# EAGLE design sensors-and-control-r2 (EAGLE 9.1.3)

## Sheet 1 of 3
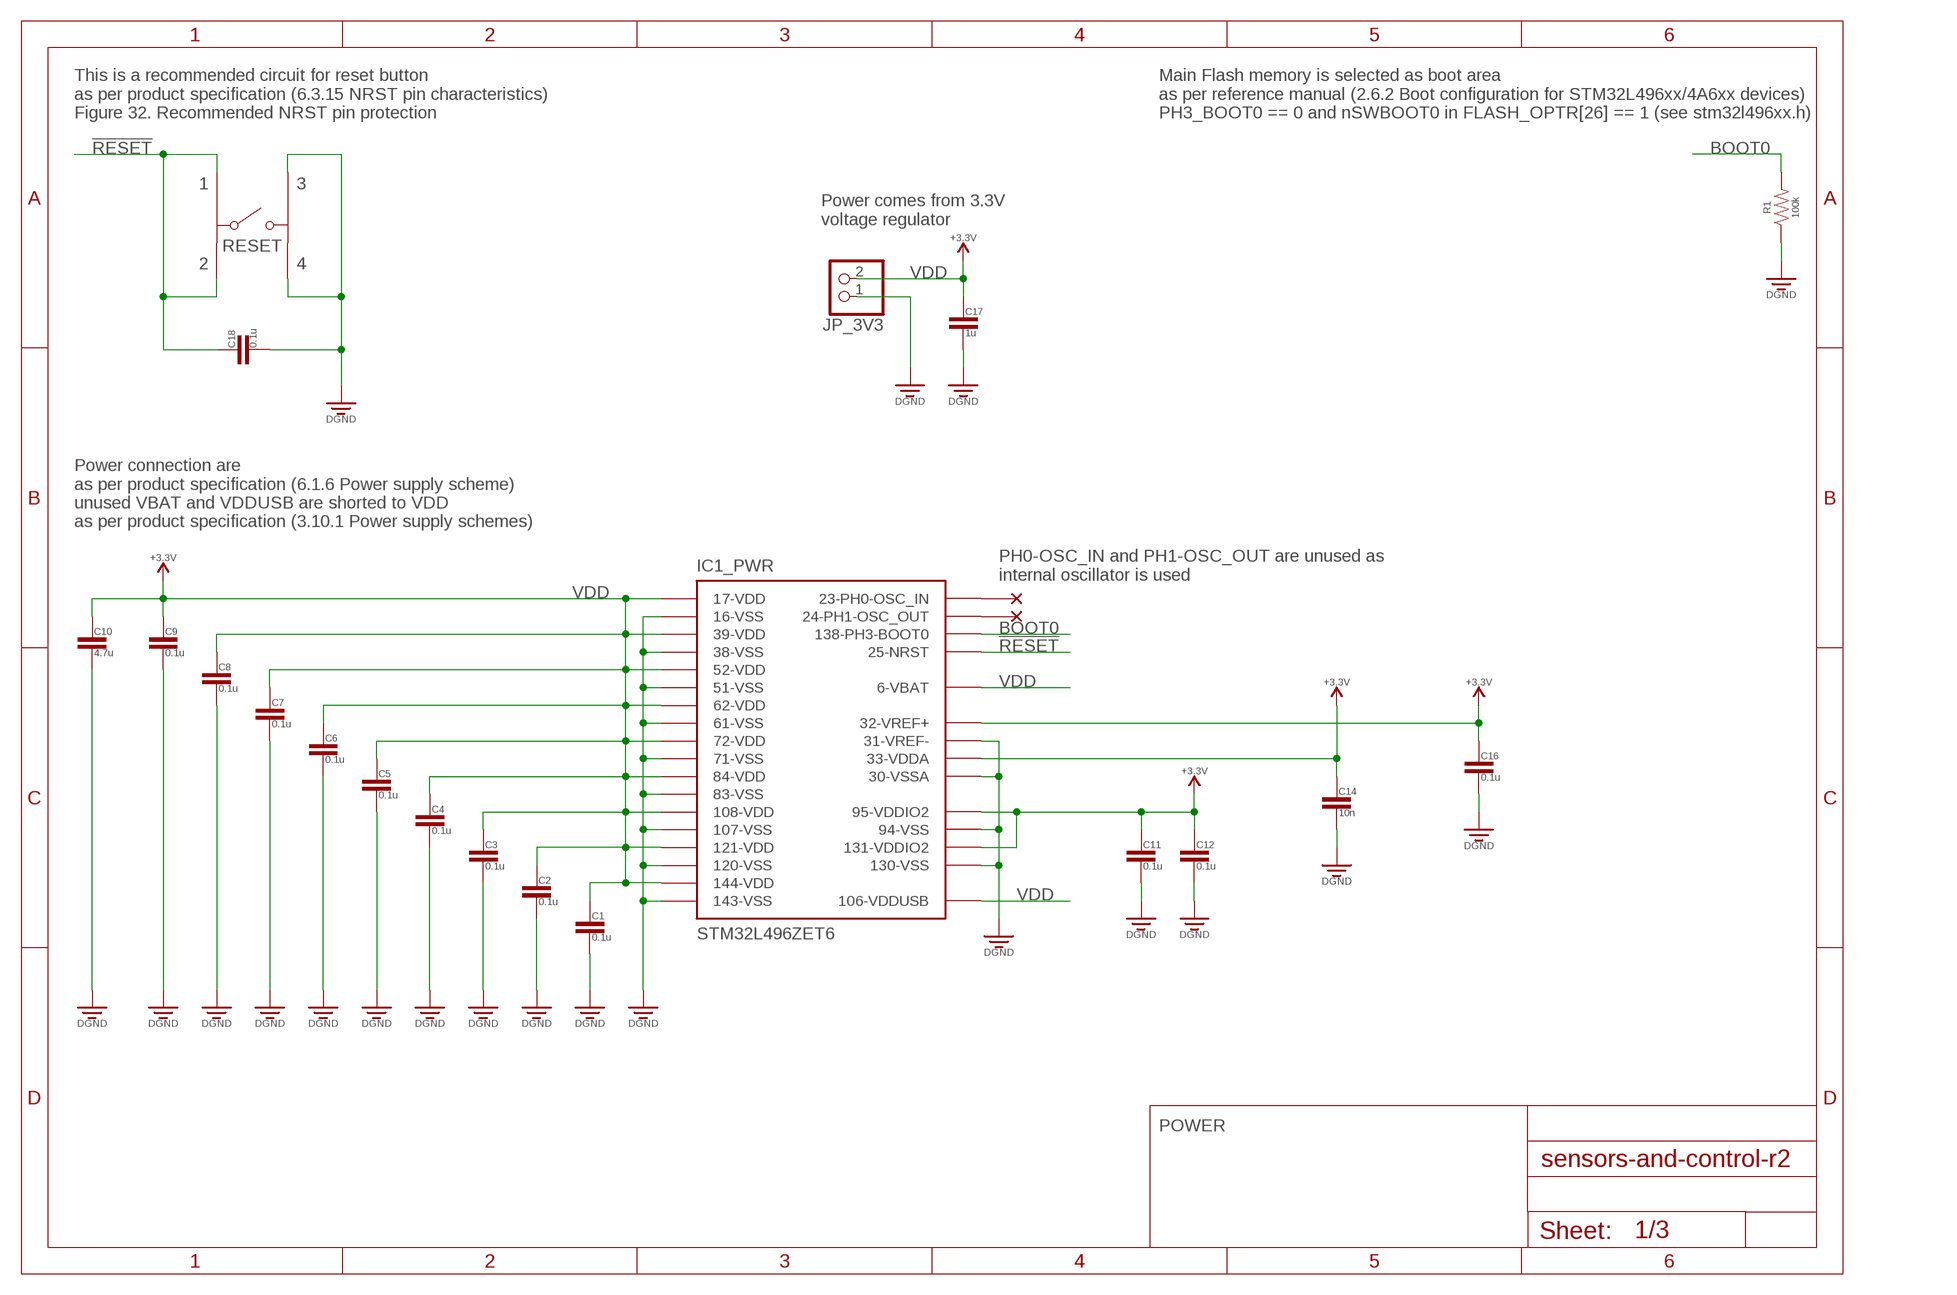
[diagram p0: schematic, sheet 1]

### Parts
C1  0.1u  CAPACITOR0603  [CAPACITOR-0603]
C2  0.1u  CAPACITOR0603  [CAPACITOR-0603]
C3  0.1u  CAPACITOR0603  [CAPACITOR-0603]
C4  0.1u  CAPACITOR0603  [CAPACITOR-0603]
C5  0.1u  CAPACITOR0603  [CAPACITOR-0603]
C6  0.1u  CAPACITOR0603  [CAPACITOR-0603]
C7  0.1u  CAPACITOR0603  [CAPACITOR-0603]
C8  0.1u  CAPACITOR0603  [CAPACITOR-0603]
C9  0.1u  CAPACITOR0603  [CAPACITOR-0603]
C10  4.7u  CAPACITOR0603  [CAPACITOR-0603]
C11  0.1u  CAPACITOR0603  [CAPACITOR-0603]
C12  0.1u  CAPACITOR0603  [CAPACITOR-0603]
C14  10n  CAPACITOR0603  [CAPACITOR-0603]
C16  0.1u  CAPACITOR0603  [CAPACITOR-0603]
C17  1u  CAPACITOR0603  [CAPACITOR-0603]
C18  0.1u  CAPACITOR0603  [CAPACITOR-0603]
IC1  STM32L496ZET6  [LQFP144_20X20]
JP_3V3  WURTH_691103110002  [2_PINS,3.5MM_PITCH]
R1  100k  RESISTOR_0.1W  [RESISTOR-0603]
RESET  FSM6JSMAASTR  [FSMJSM]
SUPPLY1  +3.3V  (no package)
SUPPLY2  +3.3V  (no package)
SUPPLY3  +3.3V  (no package)
SUPPLY4  +3.3V  (no package)
SUPPLY5  +3.3V  (no package)
U$2  NC  (no package)
U$3  NC  (no package)

### Nets
!RESET: C18.1 IC1.25(_PWR:25-NRST) RESET.P$2 RESET.P$4 ; also sheet 2
BOOT0: IC1.138(_PWR:138-PH3-BOOT0) R1.P$2
DGND: C1.2 C2.2 C3.2 C4.2 C5.2 C6.2 C7.2 C8.2 C9.2 C10.2 C11.2 C12.2 C14.2 C16.2 C17.2 C18.2 IC1.16(_PWR:16-VSS) IC1.30(_PWR:30-VSSA) IC1.31(_PWR:31-VREF-) IC1.38(_PWR:38-VSS) IC1.51(_PWR:51-VSS) IC1.61(_PWR:61-VSS) IC1.71(_PWR:71-VSS) IC1.83(_PWR:83-VSS) IC1.94(_PWR:94-VSS) IC1.107(_PWR:107-VSS) IC1.120(_PWR:120-VSS) IC1.130(_PWR:130-VSS) IC1.143(_PWR:143-VSS) JP_3V3.1 R1.P$1 RESET.P$1 RESET.P$3 ; also sheet 2,3
N$4: IC1.24(_PWR:24-PH1-OSC_OUT) U$2.1
N$5: IC1.23(_PWR:23-PH0-OSC_IN) U$3.1
VDD: C1.1 C2.1 C3.1 C4.1 C5.1 C6.1 C7.1 C8.1 C9.1 C10.1 C11.1 C12.1 C14.1 C16.1 C17.1 IC1.6(_PWR:6-VBAT) IC1.17(_PWR:17-VDD) IC1.32(_PWR:32-VREF+) IC1.33(_PWR:33-VDDA) IC1.39(_PWR:39-VDD) IC1.52(_PWR:52-VDD) IC1.62(_PWR:62-VDD) IC1.72(_PWR:72-VDD) IC1.84(_PWR:84-VDD) IC1.95(_PWR:95-VDDIO2) IC1.106(_PWR:106-VDDUSB) IC1.108(_PWR:108-VDD) IC1.121(_PWR:121-VDD) IC1.131(_PWR:131-VDDIO2) IC1.144(_PWR:144-VDD) JP_3V3.2 SUPPLY1.VCC SUPPLY2.VCC SUPPLY3.VCC SUPPLY4.VCC SUPPLY5.VCC ; also sheet 2,3

### Notes on the sheet
- This is a recommended circuit for reset button
  as per product specification (6.3.15 NRST pin characteristics)
  Figure 32. Recommended NRST pin protection
- Main Flash memory is selected as boot area
  as per reference manual (2.6.2 Boot configuration for STM32L496xx/4A6xx devices)
  PH3_BOOT0 == 0 and nSWBOOT0 in FLASH_OPTR[26] == 1 (see stm32l496xx.h)
- Power comes from 3.3V
  voltage regulator
- Power connection are
  as per product specification (6.1.6 Power supply scheme)
  unused VBAT and VDDUSB are shorted to VDD
  as per product specification (3.10.1 Power supply schemes)
- PH0-OSC_IN and PH1-OSC_OUT are unused as
  internal oscillator is used
- POWER

## Sheet 2 of 3
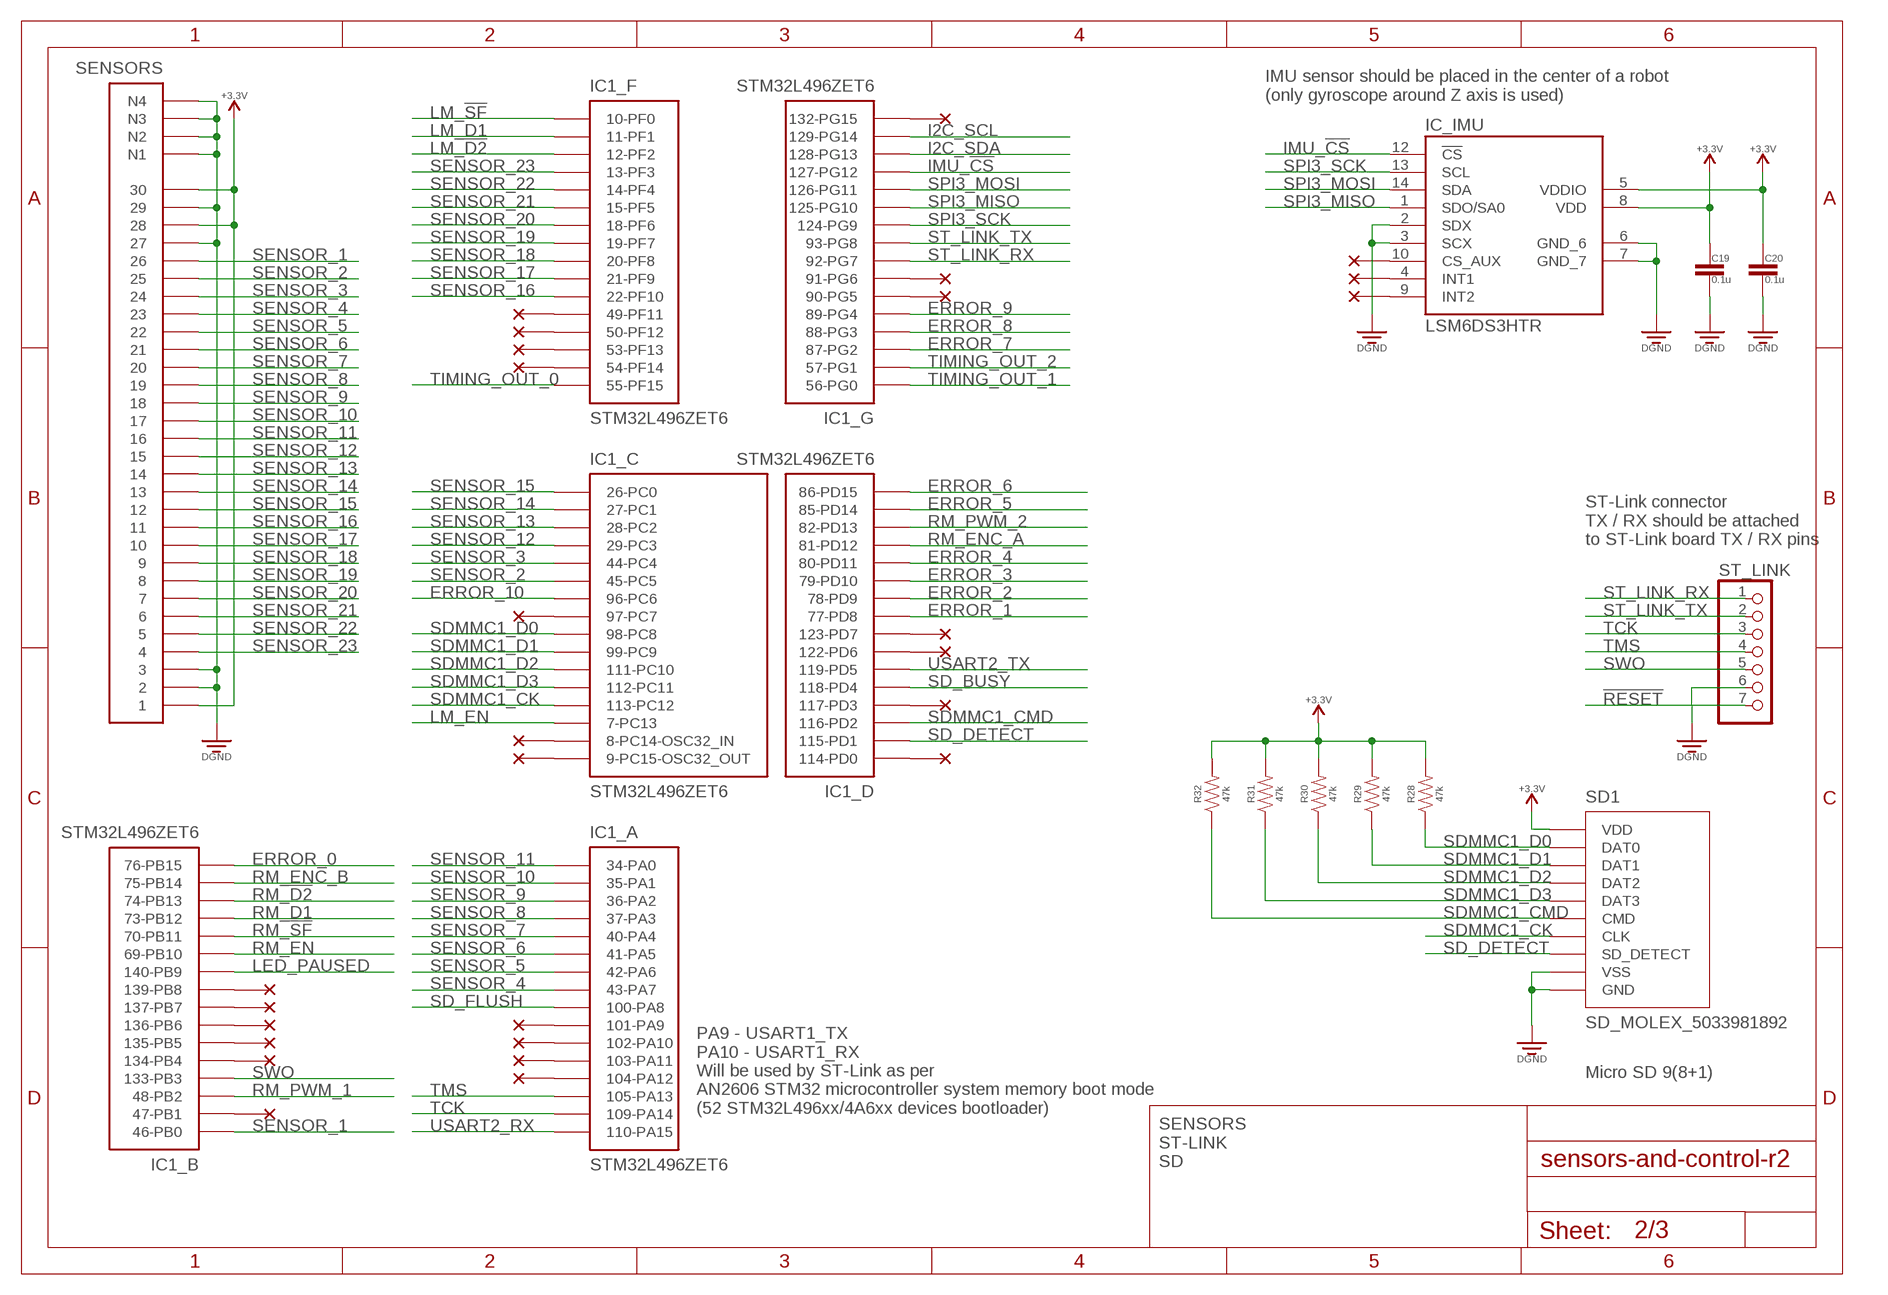
[diagram p1: schematic, sheet 2]

### Parts
C19  0.1u  CAPACITOR0603  [CAPACITOR-0603]
C20  0.1u  CAPACITOR0603  [CAPACITOR-0603]
IC_IMU  LSM6DS3HTR  [LGA-14L]
R28  47k  RESISTOR_0.1W  [RESISTOR-0603]
R29  47k  RESISTOR_0.1W  [RESISTOR-0603]
R30  47k  RESISTOR_0.1W  [RESISTOR-0603]
R31  47k  RESISTOR_0.1W  [RESISTOR-0603]
R32  47k  RESISTOR_0.1W  [RESISTOR-0603]
SD1  SD_MOLEX_5033981892  [SD_MOLEX_5033981892]
SENSORS  MOLEX-501931-3070  [MOLEX-501931-3070]
ST_LINK  PINHD-1X7  [1X07]
SUPPLY6  +3.3V  (no package)
SUPPLY7  +3.3V  (no package)
SUPPLY8  +3.3V  (no package)
SUPPLY9  +3.3V  (no package)
SUPPLY14  +3.3V  (no package)
U$1  NC  (no package)
U$4  NC  (no package)
U$5  NC  (no package)
U$11  NC  (no package)
U$12  NC  (no package)
U$13  NC  (no package)
U$14  NC  (no package)
U$15  NC  (no package)
U$16  NC  (no package)
U$17  NC  (no package)
U$18  NC  (no package)
U$19  NC  (no package)
U$20  NC  (no package)
U$21  NC  (no package)
U$22  NC  (no package)
U$23  NC  (no package)
U$25  NC  (no package)
U$26  NC  (no package)
U$27  NC  (no package)
U$29  NC  (no package)
U$31  NC  (no package)
U$32  NC  (no package)
U$33  NC  (no package)
U$34  NC  (no package)
U$35  NC  (no package)
U$36  NC  (no package)
U$37  NC  (no package)

### Nets
!RESET: ST_LINK.7 ; also sheet 1
DGND: C19.2 C20.2 IC_IMU.2(SDX) IC_IMU.3(SCX) IC_IMU.6(GND_6) IC_IMU.7(GND_7) SD1.6(VSS) SD1.DLM(GND) SENSORS.2 SENSORS.3 SENSORS.27 SENSORS.29 SENSORS.NAIL1(N1) SENSORS.NAIL2(N2) SENSORS.NAIL3(N3) SENSORS.NAIL4(N4) ST_LINK.6 ; also sheet 1,3
ERROR_0: IC1.76(_B:76-PB15) ; also sheet 3
ERROR_1: IC1.77(_D:77-PD8) ; also sheet 3
ERROR_2: IC1.78(_D:78-PD9) ; also sheet 3
ERROR_3: IC1.79(_D:79-PD10) ; also sheet 3
ERROR_4: IC1.80(_D:80-PD11) ; also sheet 3
ERROR_5: IC1.85(_D:85-PD14) ; also sheet 3
ERROR_6: IC1.86(_D:86-PD15) ; also sheet 3
ERROR_7: IC1.87(_G:87-PG2) ; also sheet 3
ERROR_8: IC1.88(_G:88-PG3) ; also sheet 3
ERROR_9: IC1.89(_G:89-PG4) ; also sheet 3
ERROR_10: IC1.96(_C:96-PC6) ; also sheet 3
I2C_SCL: IC1.129(_G:129-PG14) ; also sheet 3
I2C_SDA: IC1.128(_G:128-PG13) ; also sheet 3
IMU_!CS: IC1.127(_G:127-PG12) IC_IMU.12(!CS!)
LED_PAUSED: IC1.140(_B:140-PB9) ; also sheet 3
LM_!D2: IC1.12(_F:12-PF2) ; also sheet 3
LM_!SF: IC1.10(_F:10-PF0) ; also sheet 3
LM_D1: IC1.11(_F:11-PF1) ; also sheet 3
LM_EN: IC1.7(_C:7-PC13) ; also sheet 3
N$1: IC_IMU.10(CS_AUX) U$1.1
N$2: IC_IMU.4(INT1) U$4.1
N$6: IC_IMU.9(INT2) U$5.1
N$27: IC1.114(_D:114-PD0) U$11.1
N$28: IC1.101(_A:101-PA9) U$12.1
N$29: IC1.117(_D:117-PD3) U$13.1
N$30: IC1.103(_A:103-PA11) U$14.1
N$31: IC1.122(_D:122-PD6) U$15.1
N$32: IC1.123(_D:123-PD7) U$16.1
N$33: IC1.91(_G:91-PG6) U$17.1
N$34: IC1.90(_G:90-PG5) U$18.1
N$35: IC1.104(_A:104-PA12) U$19.1
N$36: IC1.49(_F:49-PF11) U$20.1
N$37: IC1.50(_F:50-PF12) U$21.1
N$38: IC1.53(_F:53-PF13) U$22.1
N$39: IC1.54(_F:54-PF14) U$23.1
N$41: IC1.97(_C:97-PC7) U$25.1
N$42: IC1.8(_C:8-PC14-OSC32_IN) U$26.1
N$43: IC1.9(_C:9-PC15-OSC32_OUT) U$27.1
N$45: IC1.132(_G:132-PG15) U$29.1
N$47: IC1.137(_B:137-PB7) U$31.1
N$48: IC1.139(_B:139-PB8) U$32.1
N$49: IC1.136(_B:136-PB6) U$33.1
N$50: IC1.135(_B:135-PB5) U$34.1
N$51: IC1.134(_B:134-PB4) U$35.1
N$52: IC1.47(_B:47-PB1) U$36.1
N$54: IC1.102(_A:102-PA10) U$37.1
RM_!D2: IC1.74(_B:74-PB13) ; also sheet 3
RM_!SF: IC1.70(_B:70-PB11) ; also sheet 3
RM_D1: IC1.73(_B:73-PB12) ; also sheet 3
RM_EN: IC1.69(_B:69-PB10) ; also sheet 3
RM_ENC_A: IC1.81(_D:81-PD12) ; also sheet 3
RM_ENC_B: IC1.75(_B:75-PB14) ; also sheet 3
RM_PWM_1: IC1.48(_B:48-PB2) ; also sheet 3
RM_PWM_2: IC1.82(_D:82-PD13) ; also sheet 3
SD_BUSY: IC1.118(_D:118-PD4) ; also sheet 3
SD_DETECT: IC1.115(_D:115-PD1) SD1.DSM(SD_DETECT)
SD_FLUSH: IC1.100(_A:100-PA8) ; also sheet 3
SDMMC1_CK: IC1.113(_C:113-PC12) SD1.5(CLK)
SDMMC1_CMD: IC1.116(_D:116-PD2) R32.P$1 SD1.3(CMD)
SDMMC1_D0: IC1.98(_C:98-PC8) R28.P$1 SD1.7(DAT0)
SDMMC1_D1: IC1.99(_C:99-PC9) R29.P$1 SD1.8(DAT1)
SDMMC1_D2: IC1.111(_C:111-PC10) R30.P$1 SD1.1(DAT2)
SDMMC1_D3: IC1.112(_C:112-PC11) R31.P$1 SD1.2(DAT3)
SENSOR_1: IC1.46(_B:46-PB0) SENSORS.26
SENSOR_2: IC1.45(_C:45-PC5) SENSORS.25
SENSOR_3: IC1.44(_C:44-PC4) SENSORS.24
SENSOR_4: IC1.43(_A:43-PA7) SENSORS.23
SENSOR_5: IC1.42(_A:42-PA6) SENSORS.22
SENSOR_6: IC1.41(_A:41-PA5) SENSORS.21
SENSOR_7: IC1.40(_A:40-PA4) SENSORS.20
SENSOR_8: IC1.37(_A:37-PA3) SENSORS.19
SENSOR_9: IC1.36(_A:36-PA2) SENSORS.18
SENSOR_10: IC1.35(_A:35-PA1) SENSORS.17
SENSOR_11: IC1.34(_A:34-PA0) SENSORS.16
SENSOR_12: IC1.29(_C:29-PC3) SENSORS.15
SENSOR_13: IC1.28(_C:28-PC2) SENSORS.14
SENSOR_14: IC1.27(_C:27-PC1) SENSORS.13
SENSOR_15: IC1.26(_C:26-PC0) SENSORS.12
SENSOR_16: IC1.22(_F:22-PF10) SENSORS.11
SENSOR_17: IC1.21(_F:21-PF9) SENSORS.10
SENSOR_18: IC1.20(_F:20-PF8) SENSORS.9
SENSOR_19: IC1.19(_F:19-PF7) SENSORS.8
SENSOR_20: IC1.18(_F:18-PF6) SENSORS.7
SENSOR_21: IC1.15(_F:15-PF5) SENSORS.6
SENSOR_22: IC1.14(_F:14-PF4) SENSORS.5
SENSOR_23: IC1.13(_F:13-PF3) SENSORS.4
SPI3_MISO: IC1.125(_G:125-PG10) IC_IMU.1(SDO/SA0)
SPI3_MOSI: IC1.126(_G:126-PG11) IC_IMU.14(SDA)
SPI3_SCK: IC1.124(_G:124-PG9) IC_IMU.13(SCL)
ST_LINK_RX: IC1.92(_G:92-PG7) ST_LINK.1
ST_LINK_TX: IC1.93(_G:93-PG8) ST_LINK.2
SWO: IC1.133(_B:133-PB3) ST_LINK.5
TCK: IC1.109(_A:109-PA14) ST_LINK.3
TIMING_OUT_0: IC1.55(_F:55-PF15) ; also sheet 3
TIMING_OUT_1: IC1.56(_G:56-PG0) ; also sheet 3
TIMING_OUT_2: IC1.57(_G:57-PG1) ; also sheet 3
TMS: IC1.105(_A:105-PA13) ST_LINK.4
USART2_RX: IC1.110(_A:110-PA15) ; also sheet 3
USART2_TX: IC1.119(_D:119-PD5) ; also sheet 3
VDD: C19.1 C20.1 IC_IMU.5(VDDIO) IC_IMU.8(VDD) R28.P$2 R29.P$2 R30.P$2 R31.P$2 R32.P$2 SD1.4(VDD) SENSORS.1 SENSORS.28 SENSORS.30 SUPPLY6.VCC SUPPLY7.VCC SUPPLY8.VCC SUPPLY9.VCC SUPPLY14.VCC ; also sheet 1,3

### Notes on the sheet
- IMU sensor should be placed in the center of a robot
  (only gyroscope around Z axis is used)
- ST-Link connector
  TX / RX should be attached
  to ST-Link board TX / RX pins
- Micro SD 9(8+1)
- PA9 - USART1_TX
  PA10 - USART1_RX
  Will be used by ST-Link as per
  AN2606 STM32 microcontroller system memory boot mode
  (52 STM32L496xx/4A6xx devices bootloader)
- SENSORS
  ST-LINK
  SD

## Sheet 3 of 3
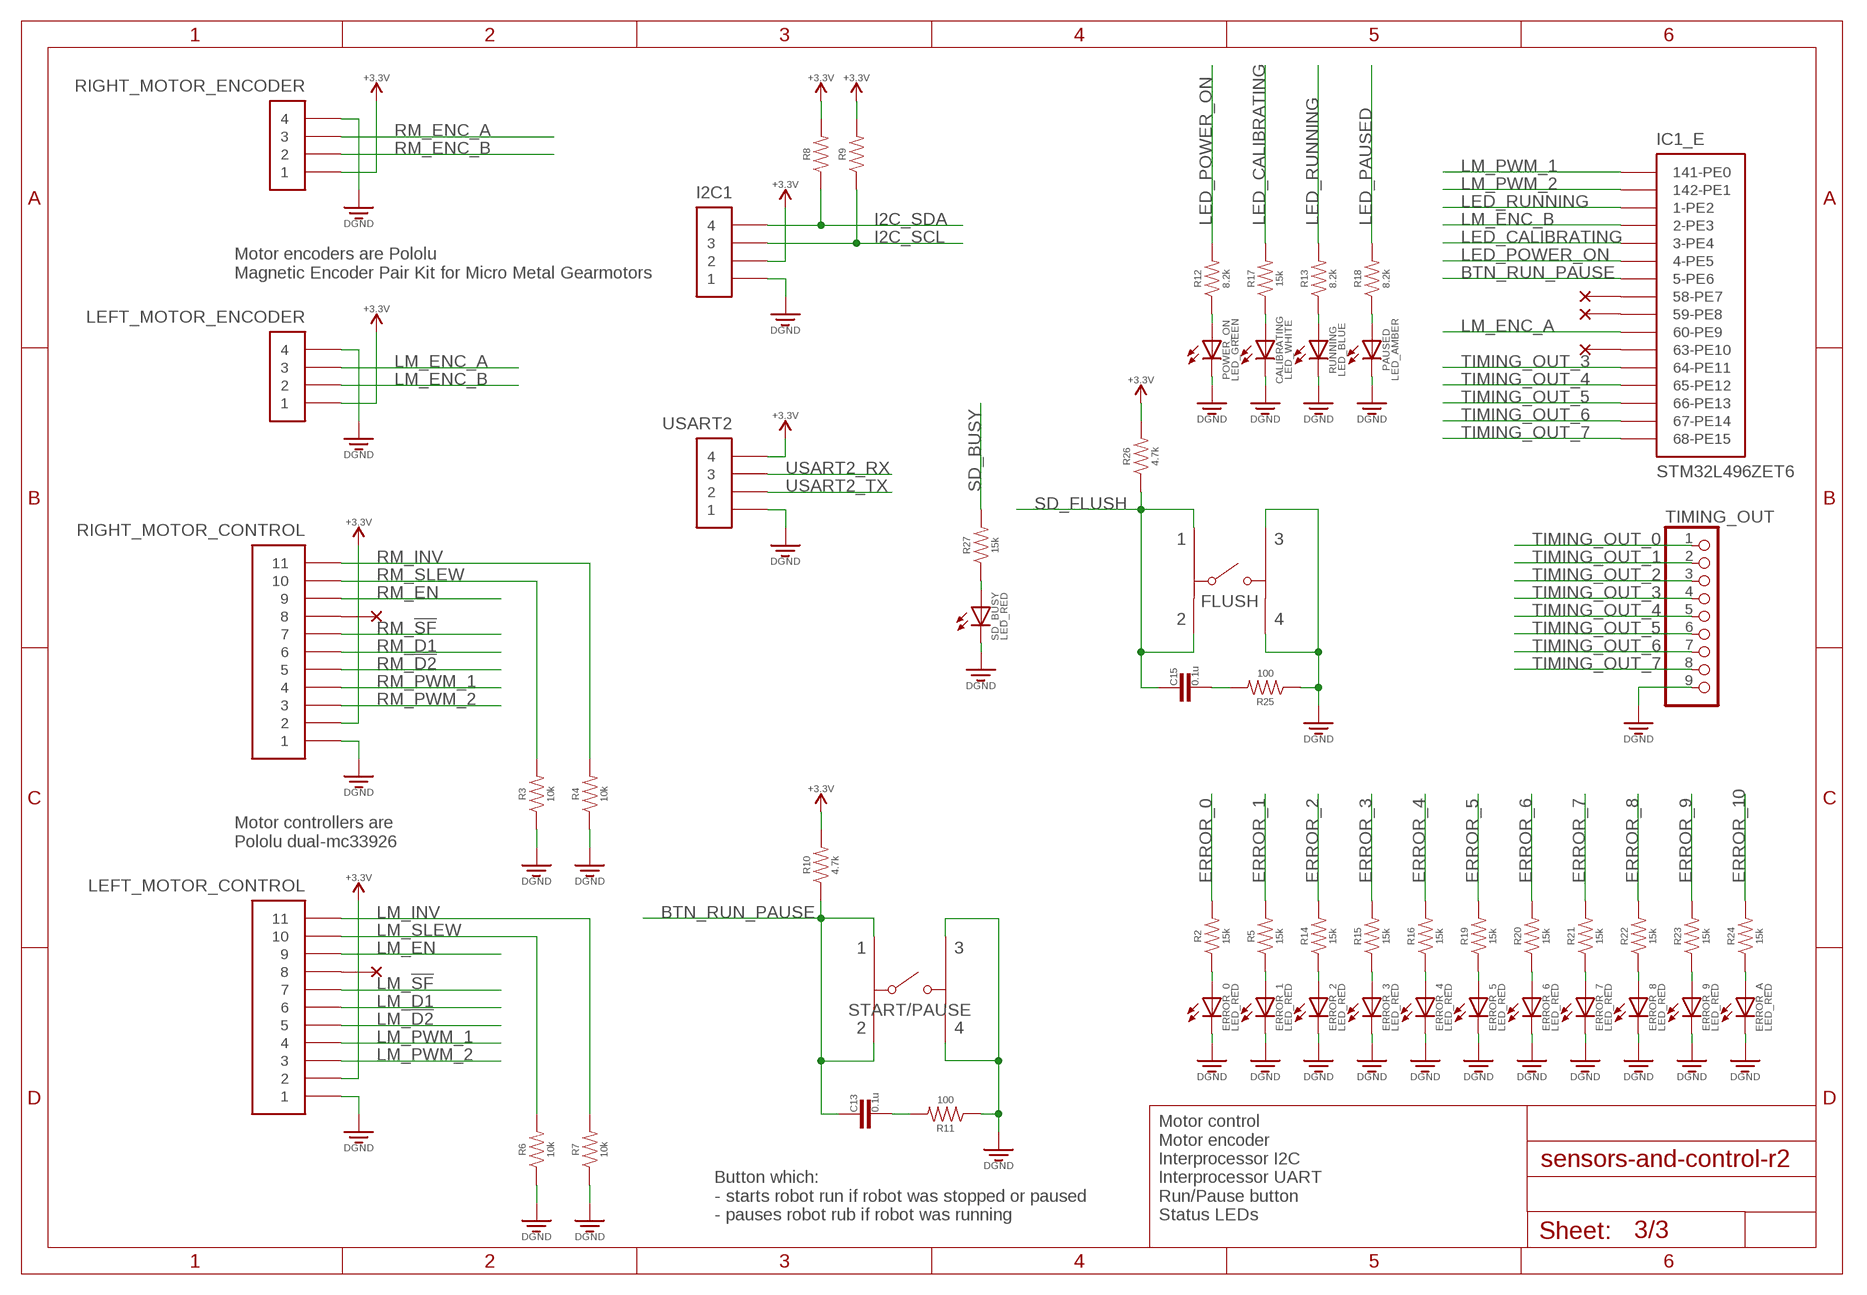
[diagram p2: schematic, sheet 3]

### Parts
C13  0.1u  CAPACITOR0603  [CAPACITOR-0603]
C15  0.1u  CAPACITOR0603  [CAPACITOR-0603]
CALIBRATING  LED_WHITE  [ESS_II_TYPE_LED]
ERROR_0  LED_RED  [ESS_II_TYPE_LED]
ERROR_1  LED_RED  [ESS_II_TYPE_LED]
ERROR_2  LED_RED  [ESS_II_TYPE_LED]
ERROR_3  LED_RED  [ESS_II_TYPE_LED]
ERROR_4  LED_RED  [ESS_II_TYPE_LED]
ERROR_5  LED_RED  [ESS_II_TYPE_LED]
ERROR_6  LED_RED  [ESS_II_TYPE_LED]
ERROR_7  LED_RED  [ESS_II_TYPE_LED]
ERROR_8  LED_RED  [ESS_II_TYPE_LED]
ERROR_9  LED_RED  [ESS_II_TYPE_LED]
ERROR_A  LED_RED  [ESS_II_TYPE_LED]
FLUSH  FSM6JSMAASTR  [FSMJSM]
I2C1  1X4  [MOLEX-70553-0003]
LEFT_MOTOR_CONTROL  1X11  [MOLEX-70553-0010]
LEFT_MOTOR_ENCODER  1X4  [MOLEX-70553-0003]
PAUSED  LED_AMBER  [ESS_II_TYPE_LED]
POWER_ON  LED_GREEN  [ESS_II_TYPE_LED]
R2  15k  RESISTOR_0.1W  [RESISTOR-0603]
R3  10k  RESISTOR_0.1W  [RESISTOR-0603]
R4  10k  RESISTOR_0.1W  [RESISTOR-0603]
R5  15k  RESISTOR_0.1W  [RESISTOR-0603]
R6  10k  RESISTOR_0.1W  [RESISTOR-0603]
R7  10k  RESISTOR_0.1W  [RESISTOR-0603]
R8  RESISTOR_0.1W  [RESISTOR-0603]
R9  RESISTOR_0.1W  [RESISTOR-0603]
R10  4.7k  RESISTOR_0.1W  [RESISTOR-0603]
R11  100  RESISTOR_0.1W  [RESISTOR-0603]
R12  8.2k  RESISTOR_0.1W  [RESISTOR-0603]
R13  8.2k  RESISTOR_0.1W  [RESISTOR-0603]
R14  15k  RESISTOR_0.1W  [RESISTOR-0603]
R15  15k  RESISTOR_0.1W  [RESISTOR-0603]
R16  15k  RESISTOR_0.1W  [RESISTOR-0603]
R17  15k  RESISTOR_0.1W  [RESISTOR-0603]
R18  8.2k  RESISTOR_0.1W  [RESISTOR-0603]
R19  15k  RESISTOR_0.1W  [RESISTOR-0603]
R20  15k  RESISTOR_0.1W  [RESISTOR-0603]
R21  15k  RESISTOR_0.1W  [RESISTOR-0603]
R22  15k  RESISTOR_0.1W  [RESISTOR-0603]
R23  15k  RESISTOR_0.1W  [RESISTOR-0603]
R24  15k  RESISTOR_0.1W  [RESISTOR-0603]
R25  100  RESISTOR_0.1W  [RESISTOR-0603]
R26  4.7k  RESISTOR_0.1W  [RESISTOR-0603]
R27  15k  RESISTOR_0.1W  [RESISTOR-0603]
RIGHT_MOTOR_CONTROL  1X11  [MOLEX-70553-0010]
RIGHT_MOTOR_ENCODER  1X4  [MOLEX-70553-0003]
RUNNING  LED_BLUE  [ESS_II_TYPE_LED]
SD_BUSY  LED_RED  [ESS_II_TYPE_LED]
START/PAUSE  FSM6JSMAASTR  [FSMJSM]
SUPPLY10  +3.3V  (no package)
SUPPLY11  +3.3V  (no package)
SUPPLY12  +3.3V  (no package)
SUPPLY13  +3.3V  (no package)
SUPPLY16  +3.3V  (no package)
SUPPLY17  +3.3V  (no package)
SUPPLY18  +3.3V  (no package)
SUPPLY19  +3.3V  (no package)
SUPPLY20  +3.3V  (no package)
TIMING_OUT  PINHD-1X9  [1X09]
U$6  NC  (no package)
U$7  NC  (no package)
U$8  NC  (no package)
U$9  NC  (no package)
U$10  NC  (no package)
USART2  1X4  [MOLEX-70553-0003]
VDD  +3.3V  (no package)

### Nets
BTN_RUN_PAUSE: C13.1 IC1.5(_E:5-PE6) R10.P$1 START/PAUSE.P$2 START/PAUSE.P$4
DGND: CALIBRATING.P$2(C) ERROR_0.P$2(C) ERROR_1.P$2(C) ERROR_2.P$2(C) ERROR_3.P$2(C) ERROR_4.P$2(C) ERROR_5.P$2(C) ERROR_6.P$2(C) ERROR_7.P$2(C) ERROR_8.P$2(C) ERROR_9.P$2(C) ERROR_A.P$2(C) FLUSH.P$1 FLUSH.P$3 I2C1.1 LEFT_MOTOR_CONTROL.P$1 LEFT_MOTOR_ENCODER.4 PAUSED.P$2(C) POWER_ON.P$2(C) R3.P$1 R4.P$1 R6.P$1 R7.P$1 R11.P$1 R25.P$1 RIGHT_MOTOR_CONTROL.P$1 RIGHT_MOTOR_ENCODER.4 RUNNING.P$2(C) SD_BUSY.P$2(C) START/PAUSE.P$1 START/PAUSE.P$3 TIMING_OUT.9 USART2.1 ; also sheet 1,2
ERROR_0: R2.P$2 ; also sheet 2
ERROR_1: R5.P$2 ; also sheet 2
ERROR_2: R14.P$2 ; also sheet 2
ERROR_3: R15.P$2 ; also sheet 2
ERROR_4: R16.P$2 ; also sheet 2
ERROR_5: R19.P$2 ; also sheet 2
ERROR_6: R20.P$2 ; also sheet 2
ERROR_7: R21.P$2 ; also sheet 2
ERROR_8: R22.P$2 ; also sheet 2
ERROR_9: R23.P$2 ; also sheet 2
ERROR_10: R24.P$2 ; also sheet 2
I2C_SCL: I2C1.3 R9.P$1 ; also sheet 2
I2C_SDA: I2C1.4 R8.P$1 ; also sheet 2
LED_CALIBRATING: IC1.3(_E:3-PE4) R17.P$2
LED_PAUSED: R18.P$2 ; also sheet 2
LED_POWER_ON: IC1.4(_E:4-PE5) R12.P$2
LED_RUNNING: IC1.1(_E:1-PE2) R13.P$2
LM_!D2: LEFT_MOTOR_CONTROL.P$5 ; also sheet 2
LM_!SF: LEFT_MOTOR_CONTROL.P$7 ; also sheet 2
LM_D1: LEFT_MOTOR_CONTROL.P$6 ; also sheet 2
LM_EN: LEFT_MOTOR_CONTROL.P$9 ; also sheet 2
LM_ENC_A: IC1.60(_E:60-PE9) LEFT_MOTOR_ENCODER.3
LM_ENC_B: IC1.2(_E:2-PE3) LEFT_MOTOR_ENCODER.2
LM_INV: LEFT_MOTOR_CONTROL.P$11 R7.P$2
LM_PWM_1: IC1.141(_E:141-PE0) LEFT_MOTOR_CONTROL.P$4
LM_PWM_2: IC1.142(_E:142-PE1) LEFT_MOTOR_CONTROL.P$3
LM_SLEW: LEFT_MOTOR_CONTROL.P$10 R6.P$2
N$3: ERROR_0.P$1(A) R2.P$1
N$7: RIGHT_MOTOR_CONTROL.P$8 U$6.1
N$8: LEFT_MOTOR_CONTROL.P$8 U$7.1
N$9: ERROR_1.P$1(A) R5.P$1
N$10: POWER_ON.P$1(A) R12.P$1
N$11: C13.2 R11.P$2
N$12: R13.P$1 RUNNING.P$1(A)
N$13: ERROR_2.P$1(A) R14.P$1
N$14: ERROR_3.P$1(A) R15.P$1
N$15: ERROR_4.P$1(A) R16.P$1
N$16: CALIBRATING.P$1(A) R17.P$1
N$17: PAUSED.P$1(A) R18.P$1
N$18: ERROR_5.P$1(A) R19.P$1
N$19: ERROR_6.P$1(A) R20.P$1
N$20: ERROR_7.P$1(A) R21.P$1
N$21: ERROR_8.P$1(A) R22.P$1
N$22: ERROR_9.P$1(A) R23.P$1
N$23: ERROR_A.P$1(A) R24.P$1
N$24: IC1.63(_E:63-PE10) U$8.1
N$25: IC1.59(_E:59-PE8) U$9.1
N$26: IC1.58(_E:58-PE7) U$10.1
N$53: C15.2 R25.P$2
N$55: R27.P$1 SD_BUSY.P$1(A)
RM_!D2: RIGHT_MOTOR_CONTROL.P$5 ; also sheet 2
RM_!SF: RIGHT_MOTOR_CONTROL.P$7 ; also sheet 2
RM_D1: RIGHT_MOTOR_CONTROL.P$6 ; also sheet 2
RM_EN: RIGHT_MOTOR_CONTROL.P$9 ; also sheet 2
RM_ENC_A: RIGHT_MOTOR_ENCODER.3 ; also sheet 2
RM_ENC_B: RIGHT_MOTOR_ENCODER.2 ; also sheet 2
RM_INV: R4.P$2 RIGHT_MOTOR_CONTROL.P$11
RM_PWM_1: RIGHT_MOTOR_CONTROL.P$4 ; also sheet 2
RM_PWM_2: RIGHT_MOTOR_CONTROL.P$3 ; also sheet 2
RM_SLEW: R3.P$2 RIGHT_MOTOR_CONTROL.P$10
SD_BUSY: R27.P$2 ; also sheet 2
SD_FLUSH: C15.1 FLUSH.P$2 FLUSH.P$4 R26.P$1 ; also sheet 2
TIMING_OUT_0: TIMING_OUT.1 ; also sheet 2
TIMING_OUT_1: TIMING_OUT.2 ; also sheet 2
TIMING_OUT_2: TIMING_OUT.3 ; also sheet 2
TIMING_OUT_3: IC1.64(_E:64-PE11) TIMING_OUT.4
TIMING_OUT_4: IC1.65(_E:65-PE12) TIMING_OUT.5
TIMING_OUT_5: IC1.66(_E:66-PE13) TIMING_OUT.6
TIMING_OUT_6: IC1.67(_E:67-PE14) TIMING_OUT.7
TIMING_OUT_7: IC1.68(_E:68-PE15) TIMING_OUT.8
USART2_RX: USART2.3 ; also sheet 2
USART2_TX: USART2.2 ; also sheet 2
VDD: I2C1.2 LEFT_MOTOR_CONTROL.P$2 LEFT_MOTOR_ENCODER.1 R8.P$2 R9.P$2 R10.P$2 R26.P$2 RIGHT_MOTOR_CONTROL.P$2 RIGHT_MOTOR_ENCODER.1 SUPPLY10.VCC SUPPLY11.VCC SUPPLY12.VCC SUPPLY13.VCC SUPPLY16.VCC SUPPLY17.VCC SUPPLY18.VCC SUPPLY19.VCC SUPPLY20.VCC USART2.4 VDD.VCC ; also sheet 1,2

### Notes on the sheet
- Motor encoders are Pololu
  Magnetic Encoder Pair Kit for Micro Metal Gearmotors
- Motor controllers are
  Pololu dual-mc33926
- Button which:
  - starts robot run if robot was stopped or paused
  - pauses robot rub if robot was running
- Motor control
  Motor encoder
  Interprocessor I2C
  Interprocessor UART
  Run/Pause button
  Status LEDs

## Library data of the parts
C1-C20 = capacitors:CAPACITOR
CALIBRATING = led:LED_WHITE
ERROR_0 ERROR_1-ERROR_9 ERROR_A SD_BUSY = led:LED_RED
FLUSH RESET START/PAUSE = switches:FSM6JSMAASTR
I2C1 LEFT_MOTOR_ENCODER RIGHT_MOTOR_ENCODER USART2 = connectors:1X4
IC1 = mcu:STM32L496ZET6
IC_IMU = sensors:LSM6DS3HTR
JP_3V3 = connectors-power:WURTH_691103110002
LEFT_MOTOR_CONTROL RIGHT_MOTOR_CONTROL = connectors:1X11
PAUSED = led:LED_AMBER
POWER_ON = led:LED_GREEN
R1-R32 = resistors:RESISTOR_0.1W
RUNNING = led:LED_BLUE
SD1 = memory-card-interfaces:SD_MOLEX_5033981892
SENSORS = connectors:MOLEX-501931-3070
ST_LINK = pin-headers:PINHD-1X7: PIN HEADER
SUPPLY1-SUPPLY14 SUPPLY16-SUPPLY20 VDD = voltage-ground:+3.3V: +3.3V Voltage Supply Positive voltage supply (traditionally for a BJT device, C=collector).
TIMING_OUT = pin-headers:PINHD-1X9: PIN HEADER
U$1-U$23 U$25-U$27 U$29 U$31-U$37 = voltage-ground:NC

## Board
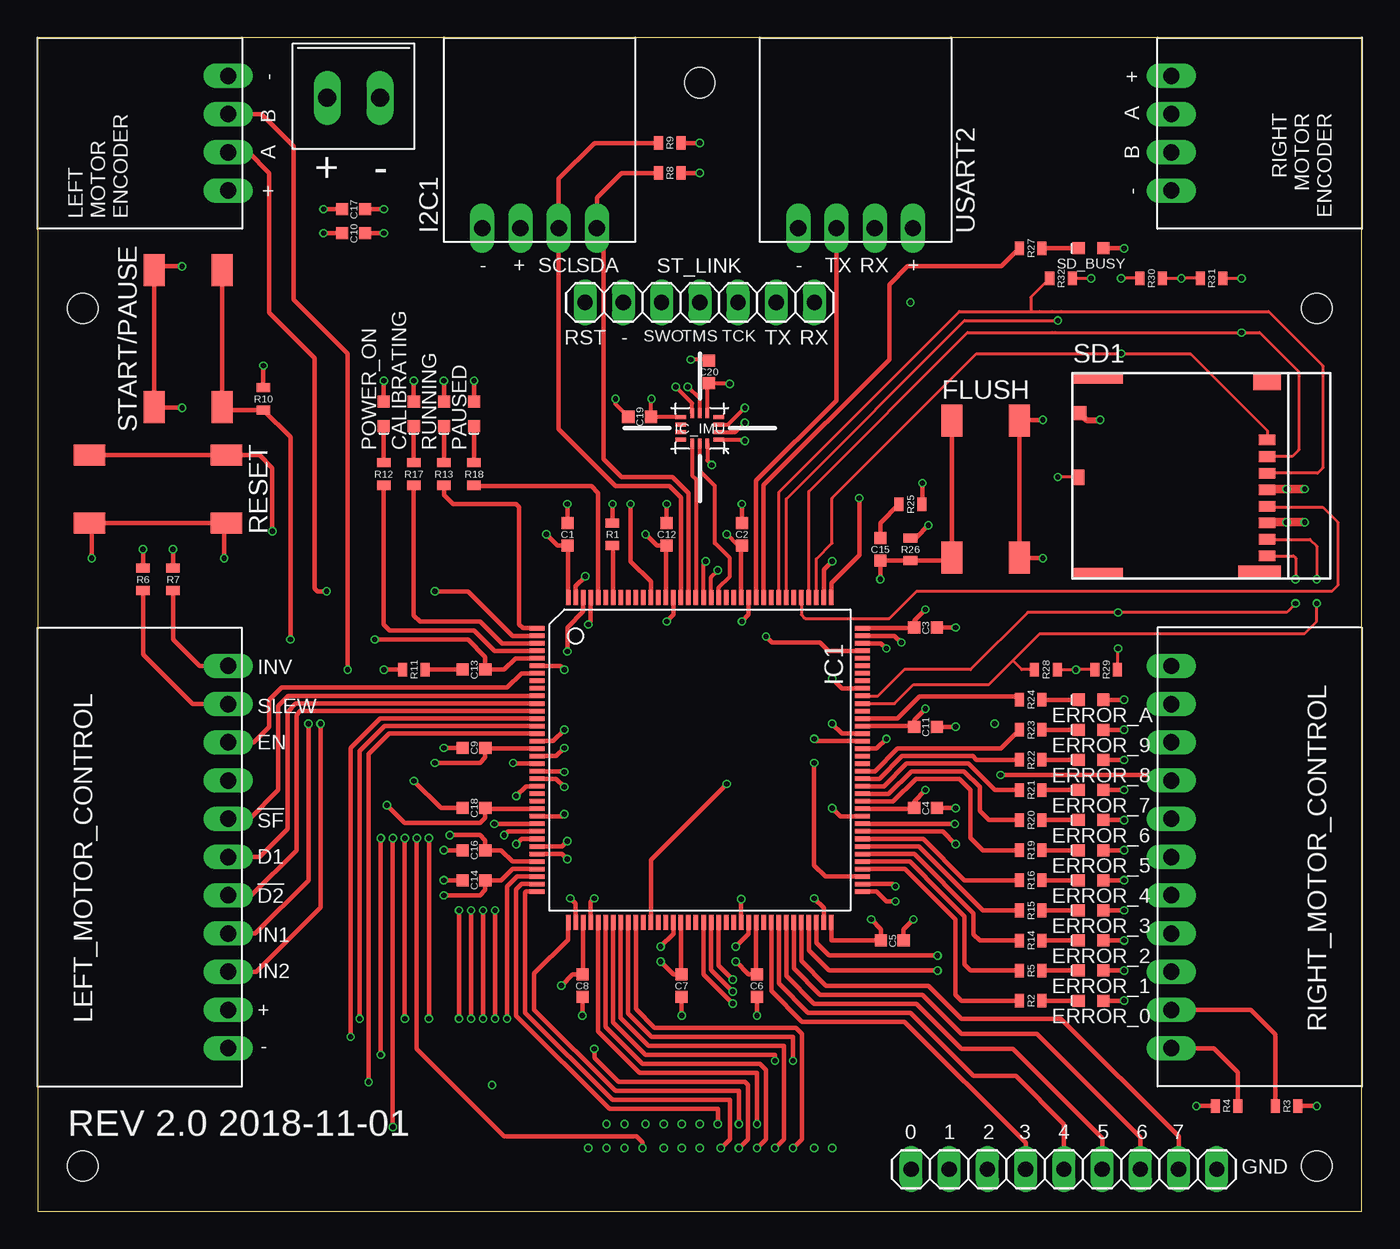
[diagram p3: board, top side]
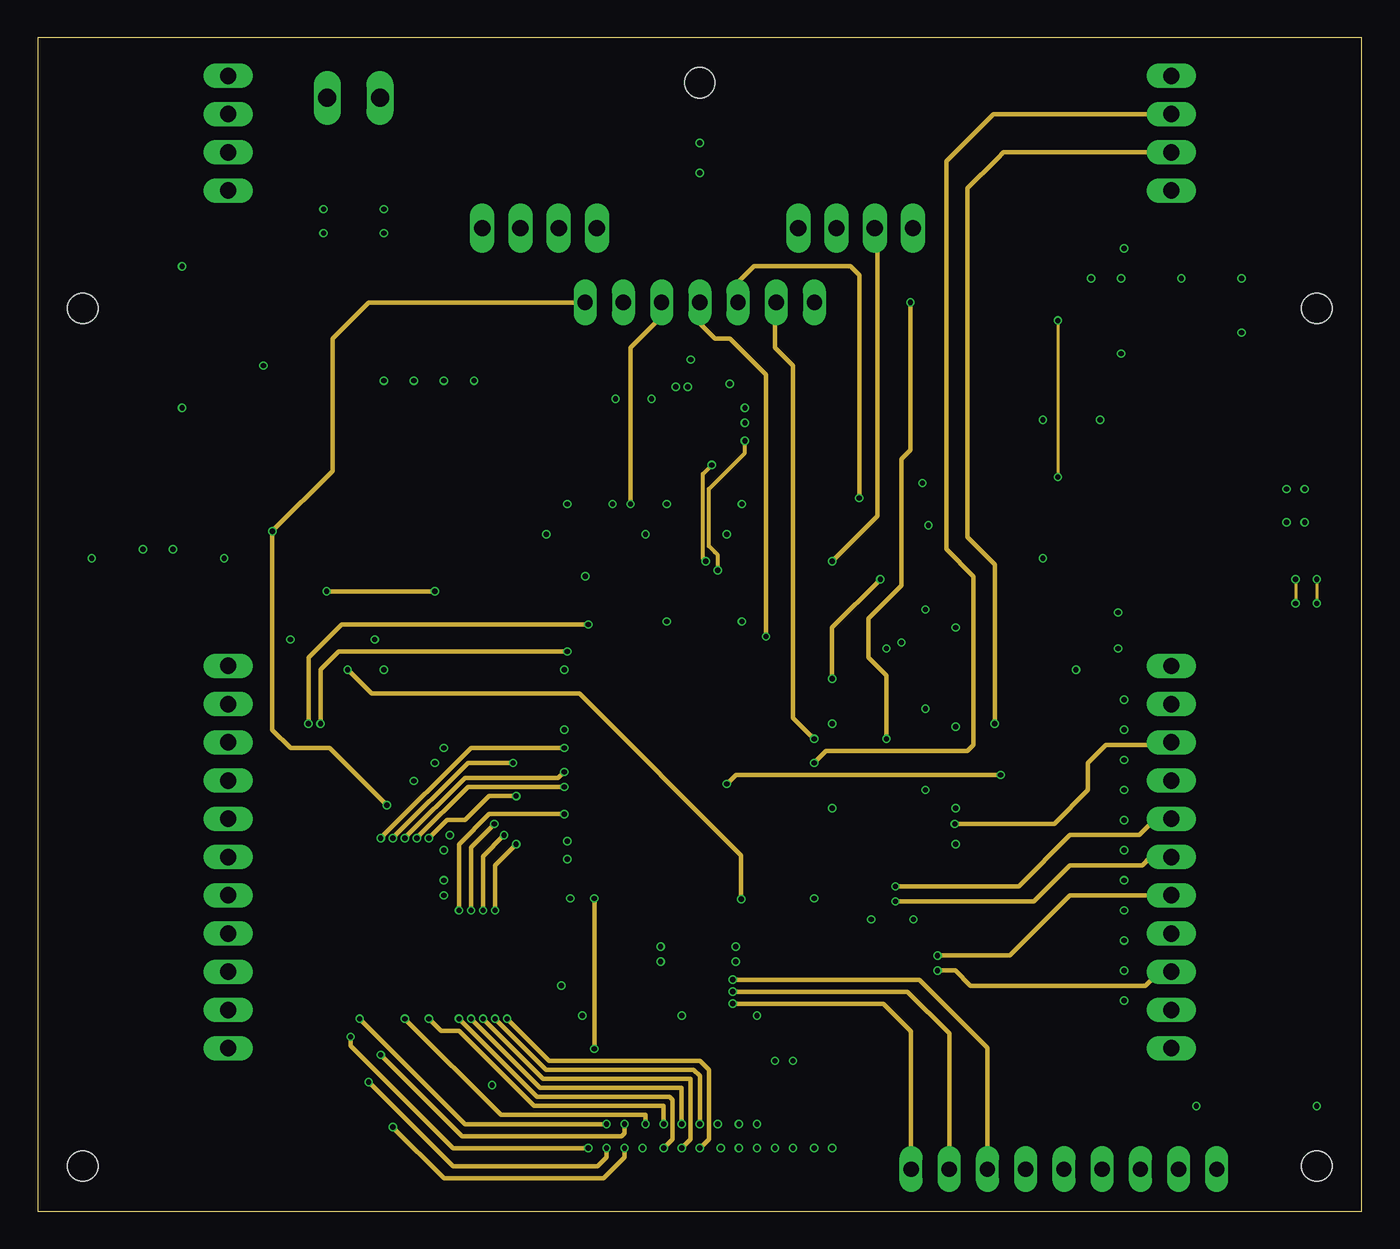
[diagram p4: board, inner layer Route2]
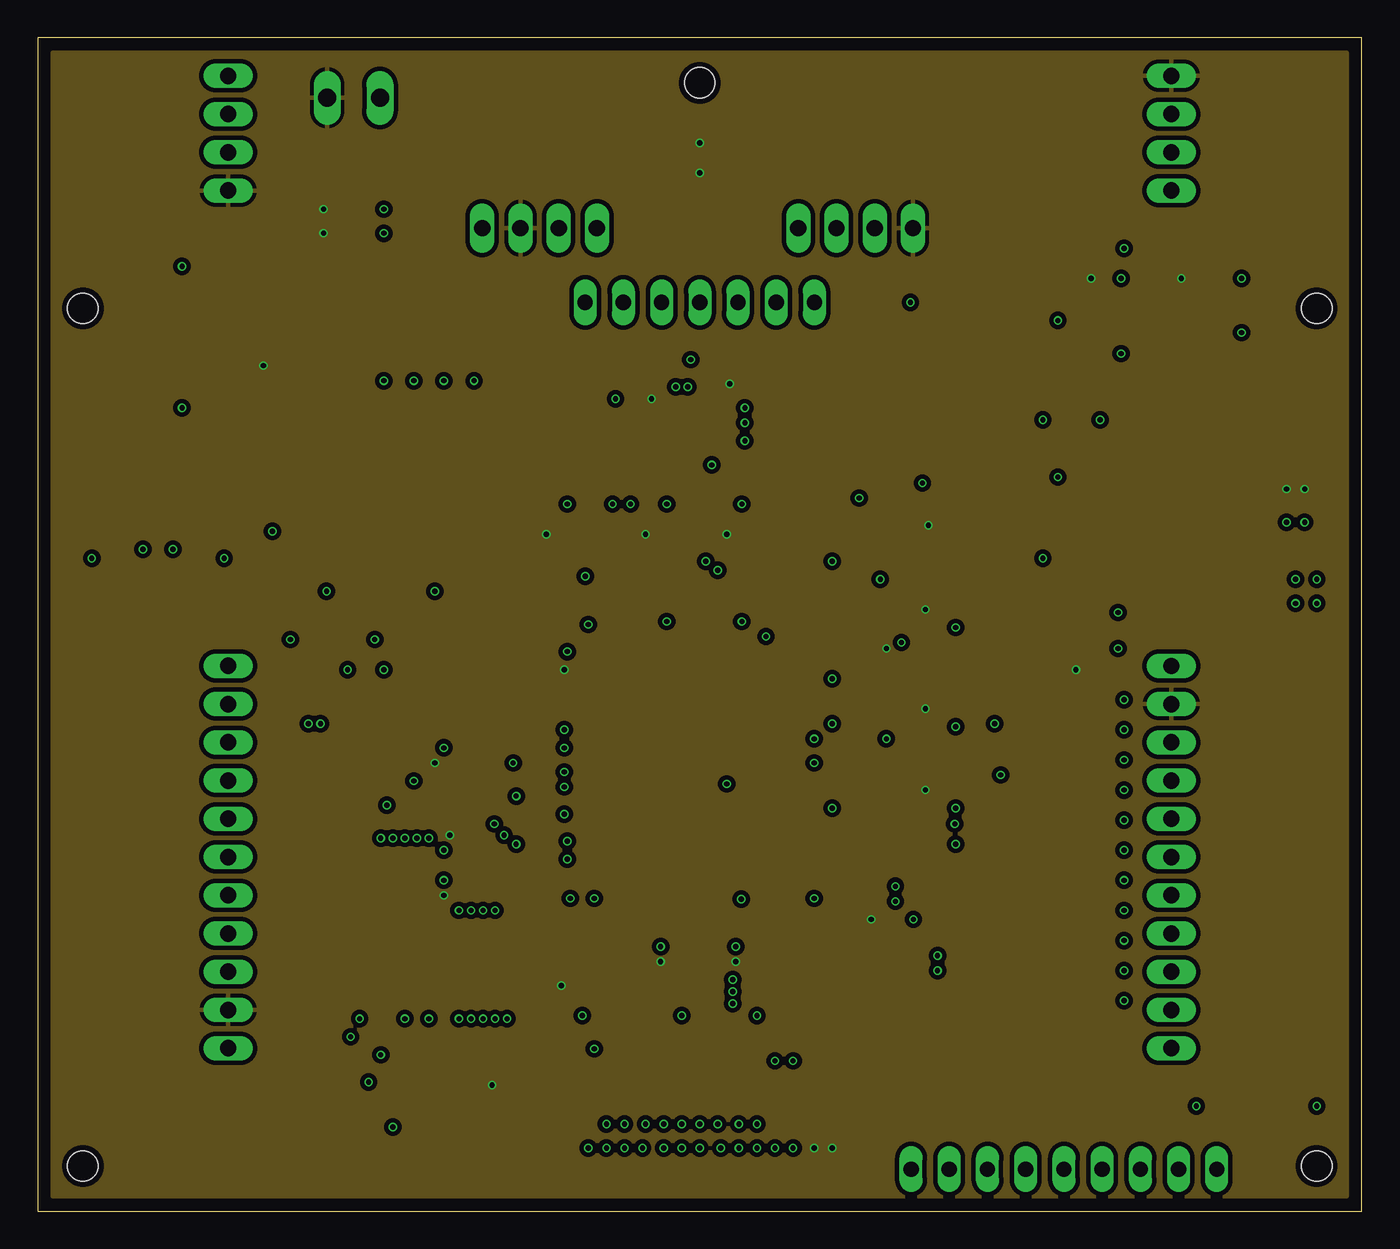
[diagram p5: board, inner layer Route15]
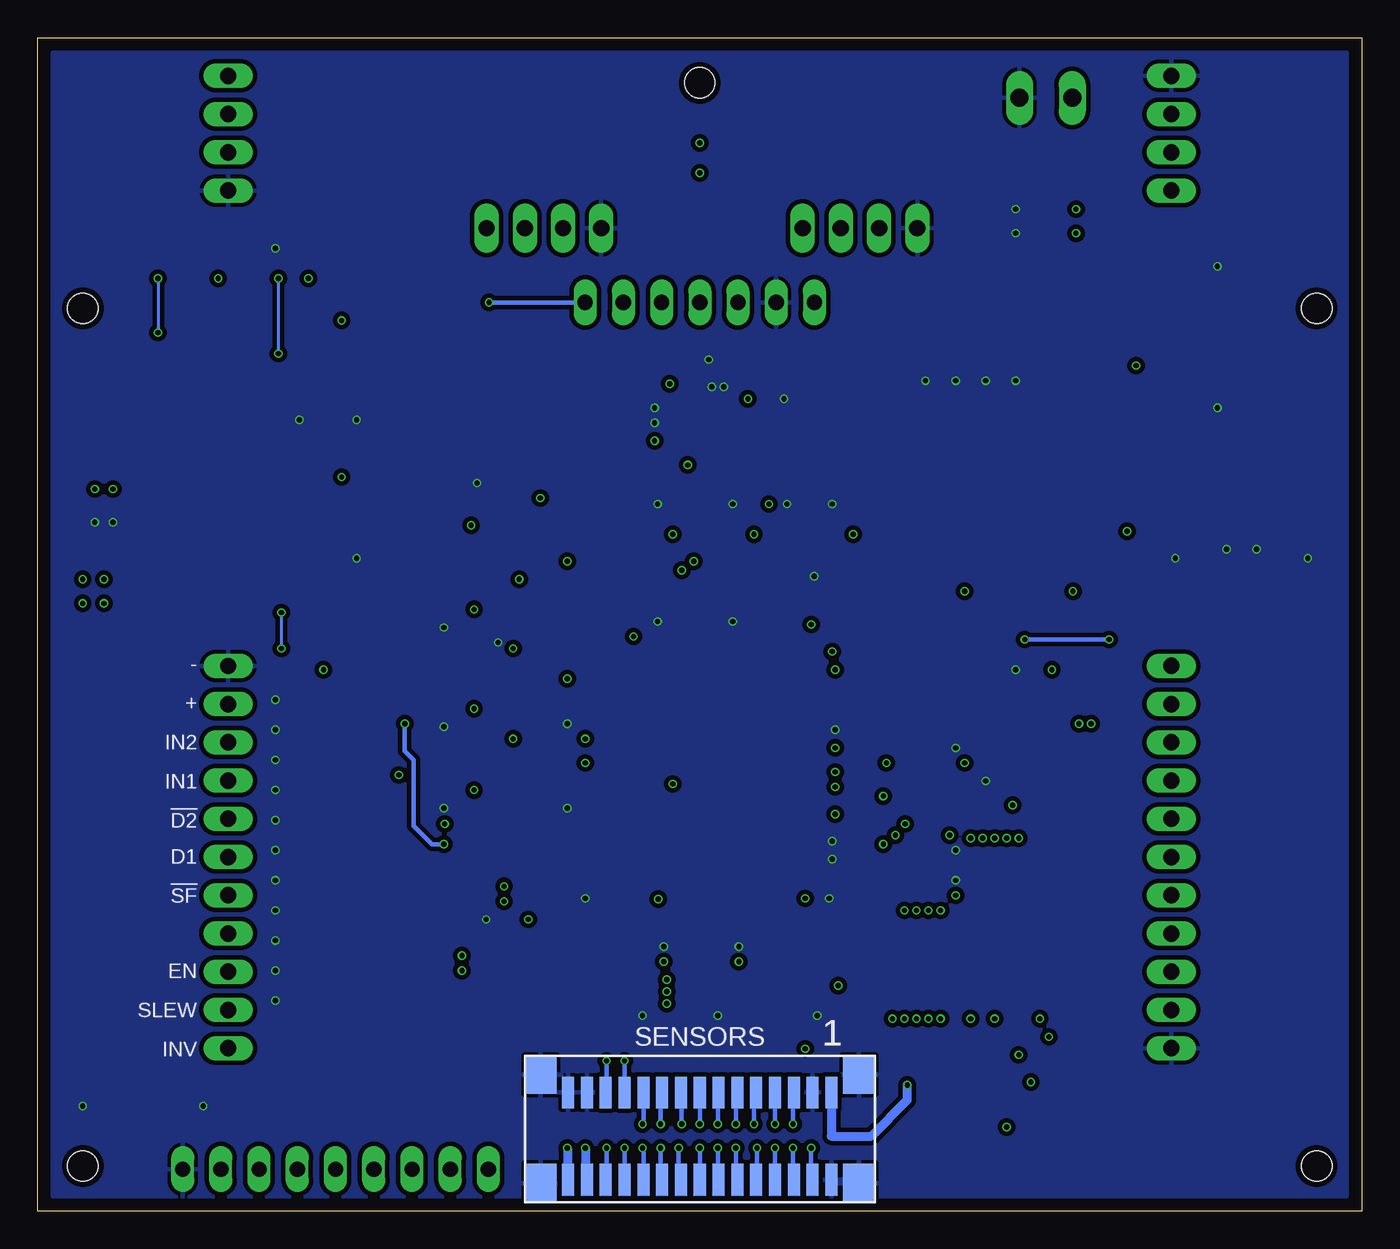
[diagram p6: board, bottom side, seen from below]

Size 88 x 78 mm. Coordinates in mm from the lower left corner, seen from the top.
Outline: 88,78 0,78 0,0 5,0 83,0 88,0 88,78
Copper layers (1*2*15*16): Top 0.035559375mm / dielectric 0.17018125mm / Route2 0.01778125mm / dielectric 47mil / Route15 0.01778125mm / dielectric 0.17018125mm / Bottom 0.035559375mm
Design rules "oshpark-4layer": minimum track width 5mil, minimum drill 10mil, track to track 5mil, track to pad 5mil, pad to pad 5mil, via to via 5mil, smd to smd 5mil, copper to edge 15mil, drill to drill 6mil, minimum pad ring 4mil, minimum via ring 4mil, stop-mask expansion 2.5mil, vias tented up to drill 0mil, thermal gap 10mil
Holes 2 mm at 85,3 3,3 85,60 3,60 44,75

### Footprints (pad centres in the part's own frame; a part is rotated, then mirrored left to right if it is on the bottom)
CAPACITOR-0603 = smd 0.8 x 0.8: 1 -0.75,0; 2 0.75,0
ESS_II_TYPE_LED = smd 0.8 x 0.8: P$1 -0.825,0; P$2 0.825,0
FSMJSM = smd 1.4 x 2.1: P$1 -2.25,-4.55; P$2 2.25,-4.55; P$3 -2.25,4.55; P$4 2.25,4.55
MOLEX-70553-0003 = drill 1.09 long: 1 2.545,-12.665; 2 5.085,-12.665; 3 7.625,-12.665; 4 10.165,-12.665
LQFP144_20X20 = smd 0.3 x 1: 1 -8.75,-10.8; 2 -8.25,-10.8; 3 -7.75,-10.8; 4 -7.25,-10.8; 5 -6.75,-10.8; 6 -6.25,-10.8; 7 -5.75,-10.8; 8 -5.25,-10.8; 9 -4.75,-10.8; 10 -4.25,-10.8; 11 -3.75,-10.8; 12 -3.25,-10.8; 13 -2.75,-10.8; 14 -2.25,-10.8; 15 -1.75,-10.8; 16 -1.25,-10.8; 17 -0.75,-10.8; 18 -0.25,-10.8; 19 0.25,-10.8; 20 0.75,-10.8; 21 1.25,-10.8; 22 1.75,-10.8; 23 2.25,-10.8; 24 2.75,-10.8; 25 3.25,-10.8; 26 3.75,-10.8; 27 4.25,-10.8; 28 4.75,-10.8; 29 5.25,-10.8; 30 5.75,-10.8; 31 6.25,-10.8; 32 6.75,-10.8; 33 7.25,-10.8; 34 7.75,-10.8; 35 8.25,-10.8; 36 8.75,-10.8; 73 8.75,10.8; 74 8.25,10.8; 75 7.75,10.8; 76 7.25,10.8; 77 6.75,10.8; 78 6.25,10.8; 79 5.75,10.8; 80 5.25,10.8; 81 4.75,10.8; 82 4.25,10.8; 83 3.75,10.8; 84 3.25,10.8; 85 2.75,10.8; 86 2.25,10.8; 87 1.75,10.8; 88 1.25,10.8; 89 0.75,10.8; 90 0.25,10.8; 91 -0.25,10.8; 92 -0.75,10.8; 93 -1.25,10.8; 94 -1.75,10.8; 95 -2.25,10.8; 96 -2.75,10.8; 97 -3.25,10.8; 98 -3.75,10.8; 99 -4.25,10.8; 100 -4.75,10.8; 101 -5.25,10.8; 102 -5.75,10.8; 103 -6.25,10.8; 104 -6.75,10.8; 105 -7.25,10.8; 106 -7.75,10.8; 107 -8.25,10.8; 108 -8.75,10.8 | smd 1 x 0.3: 37 10.8,-8.75; 38 10.8,-8.25; 39 10.8,-7.75; 40 10.8,-7.25; 41 10.8,-6.75; 42 10.8,-6.25; 43 10.8,-5.75; 44 10.8,-5.25; 45 10.8,-4.75; 46 10.8,-4.25; 47 10.8,-3.75; 48 10.8,-3.25; 49 10.8,-2.75; 50 10.8,-2.25; 51 10.8,-1.75; 52 10.8,-1.25; 53 10.8,-0.75; 54 10.8,-0.25; 55 10.8,0.25; 56 10.8,0.75; 57 10.8,1.25; 58 10.8,1.75; 59 10.8,2.25; 60 10.8,2.75; 61 10.8,3.25; 62 10.8,3.75; 63 10.8,4.25; 64 10.8,4.75; 65 10.8,5.25; 66 10.8,5.75; 67 10.8,6.25; 68 10.8,6.75; 69 10.8,7.25; 70 10.8,7.75; 71 10.8,8.25; 72 10.8,8.75; 109 -10.8,8.75; 110 -10.8,8.25; 111 -10.8,7.75; 112 -10.8,7.25; 113 -10.8,6.75; 114 -10.8,6.25; 115 -10.8,5.75; 116 -10.8,5.25; 117 -10.8,4.75; 118 -10.8,4.25; 119 -10.8,3.75; 120 -10.8,3.25; 121 -10.8,2.75; 122 -10.8,2.25; 123 -10.8,1.75; 124 -10.8,1.25; 125 -10.8,0.75; 126 -10.8,0.25; 127 -10.8,-0.25; 128 -10.8,-0.75; 129 -10.8,-1.25; 130 -10.8,-1.75; 131 -10.8,-2.25; 132 -10.8,-2.75; 133 -10.8,-3.25; 134 -10.8,-3.75; 135 -10.8,-4.25; 136 -10.8,-4.75; 137 -10.8,-5.25; 138 -10.8,-5.75; 139 -10.8,-6.25; 140 -10.8,-6.75; 141 -10.8,-7.25; 142 -10.8,-7.75; 143 -10.8,-8.25; 144 -10.8,-8.75
LGA-14L = smd 0.675 x 0.25: 1 -1.262,0.75; 2 -1.262,0.25; 3 -1.262,-0.25; 4 -1.262,-0.75; 8 1.262,-0.75; 9 1.262,-0.25; 10 1.262,0.25; 11 1.262,0.75 | smd 0.25 x 0.675: 5 -0.5,-1.012; 6 0,-1.012; 7 0.5,-1.012; 12 0.5,1.012; 13 0,1.012; 14 -0.5,1.012
2_PINS,3.5MM_PITCH = drill 1.2 long: 1 -1.75,0; 2 1.75,0
MOLEX-70553-0010 = drill 1.09 long: P$1 2.545,-12.665; P$2 5.085,-12.665; P$3 7.625,-12.665; P$4 10.165,-12.665; P$5 12.705,-12.665; P$6 15.245,-12.665; P$7 17.785,-12.665; P$8 20.325,-12.665; P$9 22.865,-12.665; P$10 25.405,-12.665; P$11 27.945,-12.665
RESISTOR-0603 = smd 0.6 x 0.9: P$1 -0.75,0; P$2 0.75,0
SD_MOLEX_5033981892 = smd 0.7 x 1.1: 1 4.45,-0.9; 2 5.55,-0.9; 3 6.65,-0.9; 4 7.75,-0.9; 5 8.85,-0.9; 6 9.95,-0.9; 7 11.05,-0.9; 8 12.15,-0.9 | smd 0.9 x 0.93: DLM 2.66,-13.365 | smd 1.05 x 0.78: DSM 6.925,-13.44 | smd 1.14 x 1.83: SM1 0.57,-0.915 | smd 0.86 x 2.8: SM2 13.23,-1.4 | smd 0.7 x 3.33: SM3 13.31,-12.165; SM4 0.35,-12.165
MOLEX-501931-3070 = smd 0.8 x 2.1: 1 8.75,2.9; 2 8.75,-2.9; 3 7.5,2.9; 4 7.5,-2.9; 5 6.25,2.9; 6 6.25,-2.9; 7 5,2.9; 8 5,-2.9; 9 3.75,2.9; 10 3.75,-2.9; 11 2.5,2.9; 12 2.5,-2.9; 13 1.25,2.9; 14 1.25,-2.9; 15 0,2.9; 16 0,-2.9; 17 -1.25,2.9; 18 -1.25,-2.9; 19 -2.5,2.9; 20 -2.5,-2.9; 21 -3.75,2.9; 22 -3.75,-2.9; 23 -5,2.9; 24 -5,-2.9; 25 -6.25,2.9; 26 -6.25,-2.9; 27 -7.5,2.9; 28 -7.5,-2.9; 29 -8.75,2.9; 30 -8.75,-2.9 | smd 2.1 x 2.55: NAIL1 10.575,4.075; NAIL2 10.575,-3.125; NAIL3 -10.575,4.075; NAIL4 -10.575,-3.125
1X07 = drill 1.016 long: 1 -7.62,0; 2 -5.08,0; 3 -2.54,0; 4 0,0; 5 2.54,0; 6 5.08,0; 7 7.62,0
1X09 = drill 1.016 long: 1 -10.16,0; 2 -7.62,0; 3 -5.08,0; 4 -2.54,0; 5 0,0; 6 2.54,0; 7 5.08,0; 8 7.62,0; 9 10.16,0

### Placement (x,y rotation side)
C1  35.2,45 90 top
C2  46.8,45 90 top
C3  59,38.8 0 top
C4  59,26.8 0 top
C5  56.8,18 0 top
C6  47.8,15 270 top
C7  42.8,15 270 top
C8  36.2,15 270 top
C9  29,30.8 180 top
C10  21,65 0 top
C11  59,32.2 0 top
C12  41.8,45 90 top
C13  29,36 180 top
C14  29,22 180 top
C15  56,44 90 top
C16  29,24 180 top
C17  21,66.6 0 top
C18  29,26.8 180 top
C19  40,52.8 180 top
C20  44.6,55.8 90 top
CALIBRATING  25,53 90 top
ERROR_0  70,14 0 top
ERROR_1  70,16 0 top
ERROR_2  70,18 0 top
ERROR_3  70,20 0 top
ERROR_4  70,22 0 top
ERROR_5  70,24 0 top
ERROR_6  70,26 0 top
ERROR_7  70,28 0 top
ERROR_8  70,30 0 top
ERROR_9  70,32 0 top
ERROR_A  70,34 0 top
FLUSH  63,48 180 top
I2C1  27,78 0 top
IC1  44,30 270 top
IC_IMU  44,52.04 180 top
JP_3V3  21,74 180 top
LEFT_MOTOR_CONTROL  0,8.3 90 top
LEFT_MOTOR_ENCODER  0,65.29 90 top
PAUSED  29,53 90 top
POWER_ON  23,53 90 top
R1  38.2,45 270 top
R2  66,14 180 top
R3  83,7 180 top
R4  79,7 0 top
R5  66,16 180 top
R6  7,42 270 top
R7  9,42 270 top
R8  42,69 0 top
R9  42,71 0 top
R10  15,54 90 top
R11  25,36 0 top
R12  23,49 270 top
R13  27,49 270 top
R14  66,18 180 top
R15  66,20 180 top
R16  66,22 180 top
R17  25,49 270 top
R18  29,49 270 top
R19  66,24 180 top
R20  66,26 180 top
R21  66,28 180 top
R22  66,30 180 top
R23  66,32 180 top
R24  66,34 180 top
R25  58,47 180 top
R26  58,44 90 top
R27  66,64 180 top
R28  67,36 0 top
R29  71,36 180 top
R30  74,62 0 top
R31  78,62 180 top
R32  68,62 0 top
RESET  8,48 90 top
RIGHT_MOTOR_CONTROL  88,38.79 270 top
RIGHT_MOTOR_ENCODER  88,78 270 top
RUNNING  27,53 90 top
SD1  82.6,55.71 270 top
SD_BUSY  70,64 0 top
SENSORS  44,5 0 bottom
ST_LINK  44,60.4 180 top
START/PAUSE  10,58 0 top
TIMING_OUT  68.2,2.8 0 top
USART2  48,78 0 top

### Tracks (layer width: path | path; a pad name or v marks a point on that pad's centre or on a via)
!RESET  (via drill 0.35)
  Top 0.3: IC1.25 29.8,26.75 C18.1 29.75,26.15 29.4,25.8 24.4,25.8 v23.2,27 | RESET.P$2 12,50.25 | 12,50.25 RESET.P$4 | v15.6,45.2 15.6,49.4 14.75,50.25 12,50.25
  Route2 0.3: ST_LINK.7 22,60.4 19.6,58 19.6,49.2 v15.6,45.2 15.6,32 16.8,30.8 19.4,30.8 v23.2,27
BOOT0
  Top 0.3: IC1.138 38.25,44.2 R1.P$2
BTN_RUN_PAUSE  (via drill 0.35)
  Top 0.3: IC1.5 31.75,36.75 31,36 C13.1 29.75,36.85 28.6,38 v22.4,38 | v16.8,38 16.8,51.45 R10.P$1 12.45,53.25 START/PAUSE.P$2 START/PAUSE.P$4
  Bottom 0.3: v22.4,38 v16.8,38
DGND  (via drill 0.35)
  Top 0.2: SD1.6 81.74,45.8
  Top 0.25: IC_IMU.3 45.89,52.29 v47,53.4 | IC_IMU.2 46.39,51.79 v47,52.4 | IC_IMU.6 44,54 v43.2,54.8 | IC_IMU.7 43.5,53.7 v42.4,54.8 | C20.2 44.55,56.6 v43.4,56.6 | C19.2 38.4,53.65 v38.4,54
  Top 0.3: C7.2 v42.8,13 | C8.2 v36.2,13 | IC1.38 35.75,20.45 v35.4,20.8 | IC1.51 42.25,18.45 v41.4,17.6 | IC1.61 47.25,18.45 v46.4,17.6 | IC1.71 52.25,20.15 v51.6,20.8 | C5.2 57.55,18.75 v58.2,19.4 | C9.2 v27,30.8 | IC1.30 34.85,24.25 v35.2,24.6 | IC1.31 34.85,23.75 v35.2,23.4 | IC1.16 34.25,31.25 v35,32 | C18.2 26.8,26.8 v25,28.6 | R11.P$1 v23,36 | C1.2 v35.2,47 | R1.P$1 v38.2,47 | POWER_ON.P$2 v23,55.2 | CALIBRATING.P$2 v25,55.2 | RUNNING.P$2 v27,55.2 | PAUSED.P$2 v29,55.2 | C17.2 v23,66.6 | C10.2 v23,65 | C4.2 v61,26.8 | C11.2 v61,32.2 | IC1.83 53.35,26.25 v52.8,26.8 | IC1.94 53.45,31.75 v52.8,32.4 | C3.2 v61,38.8 | ERROR_0.P$2 v72.2,14 | ERROR_1.P$2 v72.2,16 | ERROR_2.P$2 v72.2,18 | ERROR_3.P$2 v72.2,20 | ERROR_4.P$2 v72.2,22 | ERROR_5.P$2 v72.2,24 | ERROR_6.P$2 v72.2,26 | ERROR_7.P$2 v72.2,28 | ERROR_8.P$2 v72.2,30 | ERROR_9.P$2 v72.2,32 | IC1.143 35.75,41.55 v36.4,42.2 | C12.2 v41.8,47 | C2.2 v46.8,47 | IC1.107 56.95,38.25 v57.4,37.8 | IC1.120 47.25,39.65 v46.8,39.2 | IC1.130 42.25,39.65 v41.8,39.2 | C16.2 v27,24 | C14.2 v27,22 | ERROR_A.P$2 v72.2,34 | v3.6,43.4 3.6,45.6 RESET.P$3 RESET.P$1 12.4,45.6 v12.4,43.4 | v9.6,62.8 8,62.8 START/PAUSE.P$3 START/PAUSE.P$1 7.8,53.4 v9.6,53.4 | R6.P$1 v7,44 | R7.P$1 v9,44 | R25.P$1 58.8,47.05 v58.8,48.4 | v66.8,43.4 65.3,43.4 FLUSH.P$3 FLUSH.P$1 65.3,52.6 v66.8,52.6 | SD_BUSY.P$2 v72.2,64 | C6.2 v47.8,13 | R4.P$1 v77,7 | R3.P$1 v85,7
  Top 0.4: SD1.DLM 69.69,52.6 v70.6,52.6
  Top 0.55: 81.74,45.8 v83,45.8 v84.2,45.8
  pour Bottom (isolate 0.3): 1,77 87,77 87,1 1,1
ERROR_0
  Top 0.3: IC1.76 57.65,22.75 61,19.4 61,14.4 61.4,14 R2.P$2
ERROR_1
  Top 0.3: IC1.77 57.95,23.25 60.1,21.1 61.6,19.6 61.6,16.4 62,16 R5.P$2
ERROR_2
  Top 0.3: R14.P$2 62.8,18 62.6,18 62.2,18.4 62.2,19.8 58.25,23.75 IC1.78
ERROR_3
  Top 0.3: IC1.79 58.55,24.25 62.8,20 R15.P$2
ERROR_4
  Top 0.3: IC1.80 58.85,24.75 61.6,22 R16.P$2
ERROR_5
  Top 0.3: R19.P$2 62.8,24 62,24.8 62,28 61.25,28.75 58.35,28.75 56.85,27.25 IC1.85
ERROR_6
  Top 0.3: R20.P$2 63.2,26 62.6,26.6 62.6,28.2 61.55,29.25 58.05,29.25 56.55,27.75 IC1.86
ERROR_7
  Top 0.3: R21.P$2 63.6,28 61.85,29.75 57.75,29.75 56.25,28.25 IC1.87
ERROR_8
  Top 0.3: R22.P$2 62.4,30 62.15,30.25 57.45,30.25 55.95,28.75 IC1.88
ERROR_9
  Top 0.3: R23.P$2 64,30.75 57.15,30.75 55.65,29.25 IC1.89
ERROR_10
  Top 0.3: IC1.96 57.15,32.75 58.6,34.2 65.05,34.2 R24.P$2
I2C_SCL
  Top 0.3: R9.P$1 37,71 34.62,68.62 I2C1.3 34.62,51.97 38.4,48.2 42,48.2 42.75,47.45 IC1.129
I2C_SDA
  Top 0.3: R8.P$1 38.8,69 37.16,67.36 I2C1.4 37.6,64.9 37.6,50 38.8,48.8 42.2,48.8 43.25,47.75 IC1.128
IMU_!CS
  Top 0.25: IC_IMU.12 43.5,48.9 43.75,48.65 IC1.127
LED_CALIBRATING
  Top 0.3: IC1.3 30.85,37.75 29.4,39.2 25.4,39.2 25,39.6 R17.P$2
LED_PAUSED
  Top 0.3: IC1.140 37.25,47.75 36.8,48.2 29.05,48.2 R18.P$2
LED_POWER_ON
  Top 0.3: IC1.4 30.35,37.25 29,38.6 23.4,38.6 23,39 R12.P$2
LED_RUNNING
  Top 0.3: IC1.1 32.25,38.75 32,39 32,46.8 31.8,47 27.6,47 27,47.6 R13.P$2
LM_!D2
  Top 0.3: IC1.12 17.45,33.25 17.2,33 17.2,24 | 17.2,24 | 17.2,24 14.21,21.01 LEFT_MOTOR_CONTROL.P$5
LM_!SF
  Top 0.3: IC1.10 16.65,34.25 16,33.6 16,28 | 16,28 | 16,28 14.09,26.09 LEFT_MOTOR_CONTROL.P$7
LM_D1
  Top 0.3: IC1.11 17.15,33.75 16.6,33.2 16.6,25.4 14.74,23.55 LEFT_MOTOR_CONTROL.P$6
LM_EN
  Top 0.3: 15.4,32.8 | 15.4,32.8 15.4,32.2 14.37,31.16 LEFT_MOTOR_CONTROL.P$9 | IC1.7 32.15,35.75 31.2,34.8 16.2,34.8 15.4,34 15.4,32.8
LM_ENC_A  (via drill 0.35)
  Top 0.3: IC1.60 v46.75,20.75 | LEFT_MOTOR_ENCODER.3 14.88,72.92 17,70.8 17,60.6 20.6,57 v20.6,36
  Route2 0.3: v20.6,36 22.2,34.4 36,34.4 46.75,23.65 v46.75,20.75
LM_ENC_B  (via drill 0.35)
  Top 0.3: IC1.2 31.55,38.25 28.6,41.2 v26.4,41.2 | v19.2,41.2 18.6,41.2 18.4,41.4 18.4,56.72 15.4,59.72 15.4,69 14.02,70.39 LEFT_MOTOR_ENCODER.2
  Route2 0.3: v19.2,41.2 v26.4,41.2
LM_INV
  Top 0.3: LEFT_MOTOR_CONTROL.P$11 10.76,36.24 9,38 R7.P$2
LM_PWM_1  (via drill 0.35)
  Top 0.3: v18,32.4 18,22 14.46,18.47 LEFT_MOTOR_CONTROL.P$4 | IC1.141 36.75,39.15 v36.6,39
  Route2 0.3: v36.6,39 20.2,39 18,36.8 v18,32.4
LM_PWM_2  (via drill 0.35)
  Top 0.3: v18.8,32.4 18.8,20.2 14.53,15.92 LEFT_MOTOR_CONTROL.P$3 | IC1.142 36.25,39.85 35.2,38.8 v35.2,37.2
  Route2 0.3: v35.2,37.2 20,37.2 18.8,36 v18.8,32.4
LM_SLEW
  Top 0.3: LEFT_MOTOR_CONTROL.P$10 10.29,33.7 7,37 R6.P$2
N$3
  Top 0.3: ERROR_0.P$1 R2.P$1
N$9
  Top 0.3: R5.P$1 ERROR_1.P$1
N$10
  Top 0.3: R12.P$1 POWER_ON.P$1
N$11
  Top 0.3: R11.P$2 C13.2
N$12
  Top 0.3: R13.P$1 RUNNING.P$1
N$13
  Top 0.3: ERROR_2.P$1 R14.P$1
N$14
  Top 0.3: R15.P$1 ERROR_3.P$1
N$15
  Top 0.3: ERROR_4.P$1 R16.P$1
N$16
  Top 0.3: R17.P$1 CALIBRATING.P$1
N$17
  Top 0.3: R18.P$1 PAUSED.P$1
N$18
  Top 0.3: R19.P$1 ERROR_5.P$1
N$19
  Top 0.3: ERROR_6.P$1 R20.P$1
N$20
  Top 0.3: ERROR_7.P$1 R21.P$1
N$21
  Top 0.3: R22.P$1 ERROR_8.P$1
N$22
  Top 0.3: R23.P$1 ERROR_9.P$1
N$23
  Top 0.3: R24.P$1 ERROR_A.P$1
N$53
  Top 0.3: C15.2 56,45.75 R25.P$2
N$55
  Top 0.3: R27.P$1 SD_BUSY.P$1
RM_!D2  (via drill 0.35)
  Top 0.3: IC1.74 56.85,21.75 v57,21.6
  Route2 0.3: 73.2,25 68.6,25 65.2,21.6 v57,21.6 | 73.2,25 | 73.2,25 74.28,26.09 RIGHT_MOTOR_CONTROL.P$5
RM_!SF  (via drill 0.35)
  Top 0.3: IC1.70 51.75,18.25 | 51.75,18.25 | 51.75,18.25 51.75,17.85 52.6,17 v59.8,17
  Route2 0.3: v59.8,17 64.6,17 68.61,21.01 RIGHT_MOTOR_CONTROL.P$7
RM_D1  (via drill 0.35)
  Top 0.3: IC1.73 55.75,21.25 56.4,20.6 v57,20.6
  Route2 0.3: v57,20.6 66.2,20.6 68.6,23 73.4,23 73.94,23.55 RIGHT_MOTOR_CONTROL.P$6
RM_EN  (via drill 0.35)
  Top 0.3: IC1.69 51.25,17.35 52.6,16 v59.8,16
  Route2 0.3: v59.8,16 61,16 62,15 73.6,15 74.53,15.92 RIGHT_MOTOR_CONTROL.P$9
RM_ENC_A  (via drill 0.35)
  Top 0.3: IC1.81 60.15,25.25 v61,24.4
  Route2 0.3: v63.6,32.4 63.6,43 61.8,44.8 61.8,68 63.7,69.9 63.8,70 64.17,70.38 RIGHT_MOTOR_ENCODER.3
  Bottom 0.3: v61,24.4 61.8,24.4 63,25.6 63,30 63.6,30.6 v63.6,32.4
RM_ENC_B  (via drill 0.35)
  Top 0.3: IC1.75 52.35,22.25 51.6,23 v51.6,29.8
  Route2 0.3: v51.6,29.8 52.4,30.6 61.8,30.6 62.2,31 62.2,42.2 60.4,44 60.4,69.8 63.52,72.92 RIGHT_MOTOR_ENCODER.2
RM_INV
  Top 0.3: RIGHT_MOTOR_CONTROL.P$11 78.16,10.84 79.75,9.25 R4.P$2
RM_PWM_1  (via drill 0.35)
  Top 0.3: IC1.48 40.75,23.35 v45.8,28.4 | v64,29 74.96,29 RIGHT_MOTOR_CONTROL.P$4
  Route2 0.3: v45.8,28.4 46.4,29 v64,29
RM_PWM_2  (via drill 0.35)
  Top 0.3: IC1.82 v60.95,25.75
  Route2 0.3: v60.95,25.75 67.55,25.75 69.8,28 69.8,29.8 71,31 75.17,31 RIGHT_MOTOR_CONTROL.P$3
RM_SLEW
  Top 0.3: RIGHT_MOTOR_CONTROL.P$10 80.61,13.38 82.25,11.75 R3.P$2
SD_BUSY
  Top 0.3: IC1.118 48.25,48.25 56.6,56.6 56.6,61.6 57.8,62.8 64.05,62.8 R27.P$2
SD_DETECT  (via drill 0.35)
  Top 0.2: IC1.115 49.75,47.35 61.6,59.2 v67.8,59.2 | SD1.DSM 69.14,48.8 v67.8,48.8
  Route2 0.2: v67.8,59.2 v67.8,48.8
SD_FLUSH  (via drill 0.35)
  Top 0.3: v56,42 C15.1 R26.P$1 60.55,43.25 FLUSH.P$4 FLUSH.P$2 | IC1.100 53.45,34.75 v52.8,35.4
  Route2 0.3: v56,42 52.8,38.8 v52.8,35.4
SDMMC1_CK
  Top 0.2: IC1.113 50.75,39.65 51,39.4 56.6,39.4 58.4,41.2 86,41.2 86.4,41.6 86.4,45.8 85.4,46.8 81.76,46.8 SD1.5
SDMMC1_CMD
  Top 0.2: SD1.3 85.06,49.06 85.4,49.4 85.4,56.2 81.8,59.8 68,59.8 67.4,59.8 66.6,59.8 66,59.8 | IC1.116 49.25,47.8 61.25,59.8 66,59.8 | R32.P$1 66,60.75 66,59.8
SDMMC1_D0  (via drill 0.35)
  Top 0.2: v85,42 85,44.2 84.54,44.66 SD1.7 | IC1.98 56.95,33.75 58.2,35 63.2,35 64.8,36.6 | v85,40.4 85,39.2 84.2,38.4 66.6,38.4 64.8,36.6 | R28.P$1 65.4,36 64.8,36.6
  Route2 0.2: v85,42 v85,40.4
SDMMC1_D1  (via drill 0.35)
  Top 0.2: v83.6,42 83.6,43.4 83.44,43.56 SD1.8 | IC1.99 55.85,34.25 57.6,36 62,36 65.8,39.8 v71.8,39.8 83,39.8 v83.6,40.4 | R29.P$1 71.8,36.05 v71.8,37.4
  Route2 0.2: v83.6,42 v83.6,40.4
  Bottom 0.2: v71.8,37.4 v71.8,39.8
SDMMC1_D2  (via drill 0.35)
  Top 0.2: SD1.1 81.7,51.9 76.6,57 74,57 v72,57 68.6,57 68.2,57 62.4,57 52.8,47.4 52.8,44.4 51.75,43.35 IC1.111 | R30.P$1 v72,62
  Bottom 0.2: v72,62 v72,57
SDMMC1_D3  (via drill 0.35)
  Top 0.2: IC1.112 51.25,47.85 61.8,58.4 67.4,58.4 67.6,58.4 v80,58.4 81.2,58.4 83.8,55.8 83.8,50.6 83.36,50.16 SD1.2 | R31.P$1 v80,62
  Bottom 0.2: v80,62 v80,58.4
SENSOR_1  (via drill 0.35)
  Top 0.3: IC1.46 39.75,13.45 41,12.2 50.4,12.2 50.8,11.8 50.8,4.8 v50.2,4.2
  Bottom 0.3: v50.2,4.2 50.2,2.15 SENSORS.26
SENSOR_2  (via drill 0.35)
  Top 0.3: IC1.45 39.25,13.15 40.8,11.6 50.2,11.6 v50.2,10
  Bottom 0.3: v50.2,10 50.2,7.95 SENSORS.25
SENSOR_3  (via drill 0.35)
  Top 0.3: IC1.44 38.75,12.85 40.6,11 49.6,11 49.6,4.8 v49,4.2
  Bottom 0.3: v49,4.2 SENSORS.24
SENSOR_4  (via drill 0.35)
  Top 0.3: IC1.43 38.25,12.55 40.4,10.4 49,10.4 v49,10
  Bottom 0.3: v49,10 SENSORS.23
SENSOR_5  (via drill 0.35)
  Top 0.3: IC1.42 37.75,12.25 40.2,9.8 46,9.8 | 46,9.8 | 46,9.8 48,9.8 48.4,9.4 48.4,4.8 v47.8,4.2
  Bottom 0.3: v47.8,4.2 47.75,4.15 SENSORS.22
SENSOR_6  (via drill 0.35)
  Top 0.3: IC1.41 37.25,11.95 40,9.2 47.8,9.2 v47.8,5.8
  Bottom 0.3: v47.8,5.8 47.75,5.85 SENSORS.21
SENSOR_7  (via drill 0.35)
  Top 0.3: v37,10.8 37,10.2 38.6,8.6 47,8.6 47.2,8.4 47.2,4.8 v46.6,4.2 | IC1.40 36.75,20.55 v37,20.8
  Route2 0.3: v37,20.8 v37,10.8
  Bottom 0.3: v46.6,4.2 46.6,2.2 SENSORS.20
SENSOR_8  (via drill 0.35)
  Top 0.3: IC1.37 35.25,18.05 33,15.8 33,13.4 38.4,8 46.6,8 v46.6,5.8
  Bottom 0.3: v46.6,5.8 46.6,7.8 SENSORS.19
SENSOR_9  (via drill 0.35)
  Top 0.3: IC1.36 32.45,21.25 32.4,21.2 32.4,13.2 38.2,7.4 46,7.4 46,4.8 v45.4,4.2
  Bottom 0.3: v45.4,4.2 45.4,2.25 SENSORS.18
SENSOR_10  (via drill 0.35)
  Top 0.3: IC1.35 32.15,21.75 31.8,21.4 31.8,13 38,6.8 44,6.8 | 44,6.8 | 44,6.8 45.2,6.8 v45.2,5.8
  Bottom 0.3: v45.2,5.8 45.2,7.85 SENSORS.17
SENSOR_11  (via drill 0.35)
  Top 0.3: IC1.34 31.85,22.25 31.2,21.6 v31.2,12.8
  Route2 0.3: v31.2,12.8 34,10 44,10 44.6,9.4 44.6,4.8 v44,4.2
  Bottom 0.3: SENSORS.16 v44,4.2
SENSOR_12  (via drill 0.35)
  Top 0.3: v30.4,12.8 v30.4,20 | IC1.29 32.15,24.75 v31.8,24.4
  Route2 0.3: v30.4,20 30.4,23 v31.8,24.4 | v30.4,12.8 33.8,9.4 43.6,9.4 44,9 v44,5.8
  Bottom 0.3: SENSORS.15 v44,5.8
SENSOR_13  (via drill 0.35)
  Top 0.3: v29.6,12.8 v29.6,20 | IC1.28 31.25,25.25 v31,25
  Route2 0.3: v31,25 29.6,23.6 v29.6,20 | v29.6,12.8 33.6,8.8 43.4,8.8 43.4,4.8 v42.8,4.2
  Bottom 0.3: SENSORS.14 42.8,2.15 v42.8,4.2
SENSOR_14  (via drill 0.35)
  Top 0.3: v28.8,12.8 v28.8,20 | IC1.27 v30.35,25.75
  Route2 0.3: v28.8,20 28.8,24.2 v30.35,25.75 | v28.8,12.8 33.4,8.2 42.8,8.2 v42.8,5.8
  Bottom 0.3: SENSORS.13 42.8,7.85 v42.8,5.8
SENSOR_15  (via drill 0.35)
  Top 0.3: v28,12.8 v28,20 | IC1.26 34.85,26.25 v35,26.4
  Route2 0.3: v28,20 28,24.4 30,26.4 v35,26.4 | v28,12.8 33.2,7.6 35.4,7.6 42,7.6 42.2,7.4 42.2,4.8 v41.6,4.2
  Bottom 0.3: SENSORS.12 41.6,2.2 v41.6,4.2
SENSOR_16  (via drill 0.35)
  Top 0.3: IC1.22 32.45,28.25 v31.8,27.6 | v26,24.8 v26,12.8
  Route2 0.3: v26,24.8 27.2,26 28.4,26 30,27.6 v31.8,27.6 | v26,12.8 26.8,12 28,12 33,7 41.6,7 v41.6,5.8
  Bottom 0.3: SENSORS.11 41.6,7.8 v41.6,5.8
SENSOR_17  (via drill 0.35)
  Top 0.3: IC1.21 34.45,28.75 v35,28.2 | v40.2,4.2 40.2,4.6 39.8,5 31,5 25.2,10.8 v25.2,24.8
  Route2 0.3: v25.2,24.8 28.6,28.2 v35,28.2
  Bottom 0.3: SENSORS.10 40.2,2.15 v40.2,4.2
SENSOR_18  (via drill 0.35)
  Top 0.3: IC1.20 34.95,29.25 v35,29.2 | v24.4,24.8 v24.4,12.8
  Route2 0.3: v24.4,24.8 28.4,28.8 34.6,28.8 v35,29.2 | v24.4,12.8 30.8,6.4 40.4,6.4 v40.4,5.8
  Bottom 0.3: SENSORS.9 40.4,7.75 v40.4,5.8
SENSOR_19  (via drill 0.35)
  Top 0.3: v23.6,24.8 23.6,14 | IC1.19 31.65,29.75 v31.6,29.8 | 23.6,14 | 23.6,14 v23.6,5.6
  Route2 0.3: v23.6,24.8 28.6,29.8 v31.6,29.8 | v23.6,5.6 27,2.2 37.6,2.2 39,3.6 v39,4.2
  Bottom 0.3: SENSORS.8 v39,4.2
SENSOR_20  (via drill 0.35)
  Top 0.3: IC1.18 34.45,30.25 v35,30.8 | v22.8,24.8 v22.8,10.4
  Route2 0.3: v22.8,24.8 28.8,30.8 v35,30.8 | v22.8,10.4 28.2,5 38.8,5 39,5.2 v39,5.8
  Bottom 0.3: SENSORS.7 v39,5.8
SENSOR_21  (via drill 0.35)
  Top 0.3: IC1.15 23.35,31.75 22,30.4 v22,8.6
  Route2 0.3: v22,8.6 27.6,3 37.2,3 37.8,3.6 v37.8,4.2
  Bottom 0.3: SENSORS.6 37.8,2.15 v37.8,4.2
SENSOR_22  (via drill 0.35)
  Top 0.3: IC1.14 23.05,32.25 21.4,30.6 v21.4,12.8
  Route2 0.3: v21.4,12.8 28.4,5.8 v37.8,5.8
  Bottom 0.3: SENSORS.5 37.8,7.85 v37.8,5.8
SENSOR_23  (via drill 0.35)
  Top 0.3: IC1.13 22.75,32.75 20.8,30.8 v20.8,11.6
  Route2 0.3: v20.8,11.6 20.8,11 27.6,4.2 v36.6,4.2
  Bottom 0.3: SENSORS.4 36.6,2.2 v36.6,4.2
SPI3_MISO  (via drill 0.35)
  Top 0.25: IC1.125 44.75,42.15 v45.2,42.6 | IC_IMU.1 46.91,51.29 v47,51.2
  Route2 0.25: v45.2,42.6 45.2,43.6 45,43.8 44.6,44.2 44.6,48 47,50.4 v47,51.2
SPI3_MOSI  (via drill 0.35)
  Top 0.25: IC1.126 44.25,43.05 v44.4,43.2 | IC_IMU.14 44.5,49.9 v44.8,49.6
  Route2 0.25: v44.4,43.2 44.2,43.4 44.2,49 v44.8,49.6
SPI3_SCK
  Top 0.25: IC1.124 45.25,41.45 46,42.2 46,43.4 45,44.4 45,48.2 44,49.2 IC_IMU.13
ST_LINK_RX  (via drill 0.35)
  Top 0.3: IC1.92 55.75,30.75 v56.4,31.4
  Route2 0.3: v56.4,31.4 56.4,35.6 55.2,36.8 55.2,39.4 57.4,41.6 57.4,50 58,50.6 v58,60.4
  Bottom 0.3: ST_LINK.1 v58,60.4
ST_LINK_TX  (via drill 0.35)
  Top 0.3: IC1.93 51.75,31.25 v51.6,31.4
  Route2 0.3: ST_LINK.2 49,60.32 49,57.4 50.2,56.2 50.2,32.8 v51.6,31.4
SWO  (via drill 0.35)
  Top 0.3: IC1.133 40.75,41.85 39.4,43.2 v39.4,47
  Route2 0.3: v39.4,47 39.4,57.4 41.46,59.46 ST_LINK.5
TCK  (via drill 0.35)
  Top 0.3: IC1.109 52.75,41.75 54.6,43.6 v54.6,47.4
  Route2 0.3: v54.6,47.4 54.6,62.2 54,62.8 47.6,62.8 46.54,61.74 ST_LINK.3
TIMING_OUT_0  (via drill 0.35)
  Top 0.3: IC1.55 44.25,15.75 v46.2,13.8
  Route2 0.3: v46.2,13.8 56.2,13.8 58.04,11.96 TIMING_OUT.1
TIMING_OUT_1  (via drill 0.35)
  Top 0.3: IC1.56 44.75,16.05 v46.2,14.6
  Route2 0.3: v46.2,14.6 57.8,14.6 60.58,11.82 TIMING_OUT.2
TIMING_OUT_2  (via drill 0.35)
  Top 0.3: IC1.57 45.25,16.35 v46.2,15.4
  Route2 0.3: v46.2,15.4 58.6,15.4 63.12,10.88 TIMING_OUT.3
TIMING_OUT_3
  Top 0.3: IC1.64 48.75,14.65 50.8,12.6 57.6,12.6 65.66,4.54 TIMING_OUT.4
TIMING_OUT_4
  Top 0.3: IC1.65 49.25,15.15 51.2,13.2 58,13.2 62.2,9 65,9 68.2,5.8 TIMING_OUT.5
TIMING_OUT_5
  Top 0.3: IC1.66 49.75,15.65 51.6,13.8 58.4,13.8 61.4,10.8 64.8,10.8 70.74,4.86 TIMING_OUT.6
TIMING_OUT_6
  Top 0.3: 67.6,10.6 | 67.6,10.6 66.4,11.8 61.4,11.8 58.8,14.4 52,14.4 50.25,16.15 IC1.67 | 67.6,10.6 73.28,4.92 TIMING_OUT.7
TIMING_OUT_7
  Top 0.3: IC1.68 50.75,17.25 | 50.75,17.25 | 50.75,17.25 50.75,16.65 52.4,15 59.2,15 61.4,12.8 68,12.8 75.82,4.98 TIMING_OUT.8
TMS  (via drill 0.35)
  Top 0.3: IC1.105 52.55,37.25 52,37.8 48.8,37.8 v48.4,38.2
  Route2 0.3: v48.4,38.2 48.4,55.6 46,58 45,58 44,59 ST_LINK.4
USART2_RX  (via drill 0.35)
  Top 0.3: IC1.110 52.25,42.65 v52.8,43.2
  Route2 0.3: v52.8,43.2 55.8,46.2 55.8,65.16 USART2.3
USART2_TX
  Top 0.3: IC1.119 47.75,48.55 53.09,53.89 USART2.2
VDD  (via drill 0.35)
  Top 0.2: SD1.4 81.74,48 | R28.P$2 v69,36 R29.P$2 | R30.P$2 v76,62 R31.P$2 | R32.P$2 v70,62
  Top 0.25: C2.1 46.55,44.25 v45.8,45 | IC_IMU.8 C19.1 40.75,53.95 v40.8,54 | IC_IMU.5 44.5,54.95 C20.1 45.95,55.05 v46,55
  Top 0.3: IC1.52 42.75,15.8 C7.1 42.25,15.75 v41.4,16.6 | IC1.62 47.75,15.8 C6.1 47.25,15.75 v46.4,16.6 | IC1.39 36.25,15.8 C8.1 35.55,15.75 v34.8,15 | IC1.33 31.55,22.75 30.8,22 C14.1 29.75,21.35 29.4,21 v27,21 | IC1.17 29.8,30.75 C9.1 29.75,30.15 29.4,29.8 v26.4,29.8 | IC1.144 35.25,44.2 C1.1 34.55,44.25 v33.8,45 | IC1.131 41.75,44.2 C12.1 41.15,44.25 v40.4,45 | IC1.121 46.75,44.2 C2.1 | IC1.108 58.2,38.75 C3.1 58.25,39.25 v59,40 | IC1.95 58.2,32.25 C11.1 58.25,32.65 v59,33.4 | IC1.84 58.2,26.75 C4.1 58.25,27.25 v59,28 | IC1.32 31.55,23.25 30.8,24 C16.1 29.75,24.65 29.4,25 v27.4,25 | IC1.72 52.75,18 C5.1 56.05,18.75 v55.4,19.4 | IC1.6 34.75,36.25 v35,36 | R10.P$2 v15,56.2 | C17.1 v19,66.6 | C10.1 v19,65 | R9.P$2 v44,71 | R8.P$2 v44,69 | IC1.106 56.05,37.75 v56.4,37.4 | R26.P$2 58.35,44.75 v59.2,45.6
  Top 0.55: 81.74,48 v83,48 v84.2,48
  Bottom 0.6: v51.6,4.2 51.6,2.2 SENSORS.28 | v52.8,4.2 52.8,2.15 SENSORS.30 | SENSORS.1 35.25,5 32.6,5 30.2,7.4 v30.2,8.4
  pour Route15 (isolate 0.3): 1,77 87,77 87,1 1,1

### Text on the board
tNames: - | + | B | A | RIGHT / MOTOR / ENCODER | A | B | + | - | + | - | LEFT / MOTOR / ENCODER | - | + | SCL | SDA | - | TX | RX | + | RST | - | SWO | TMS | TCK | TX | RX | INV | SLEW | EN | !SF | D1 | !D2 | IN1 | IN2 | + | - | REV 2.0 2018-11-01 | 0 | 1 | 2 | 3 | 4 | 5 | 6 | 7 | GND
bNames: - | + | IN2 | IN1 | !D2 | D1 | !SF | EN | SLEW | 1 | INV